# EAGLE board EEZ DIB MIO168 r1B5 (EAGLE 7.2.0), part 1 of 2
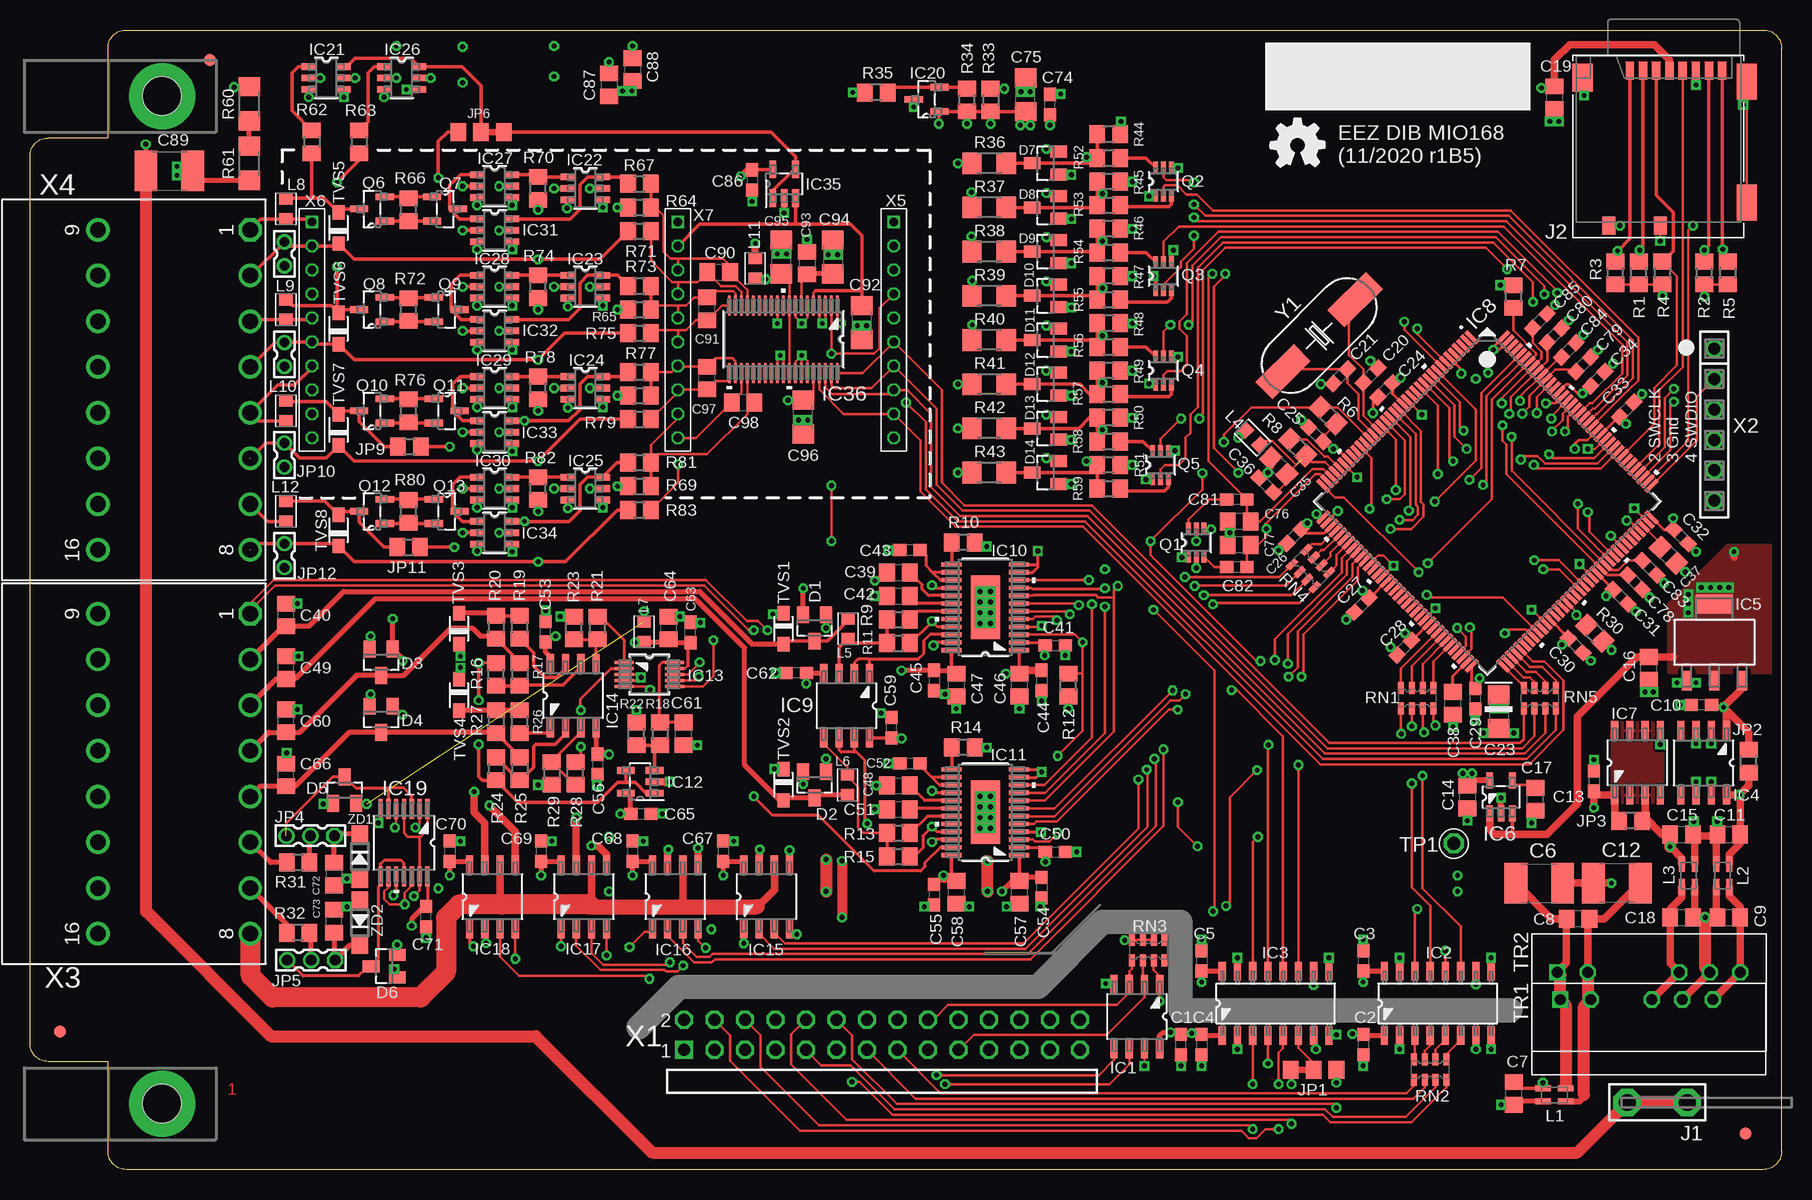
[diagram p6: board, top side]
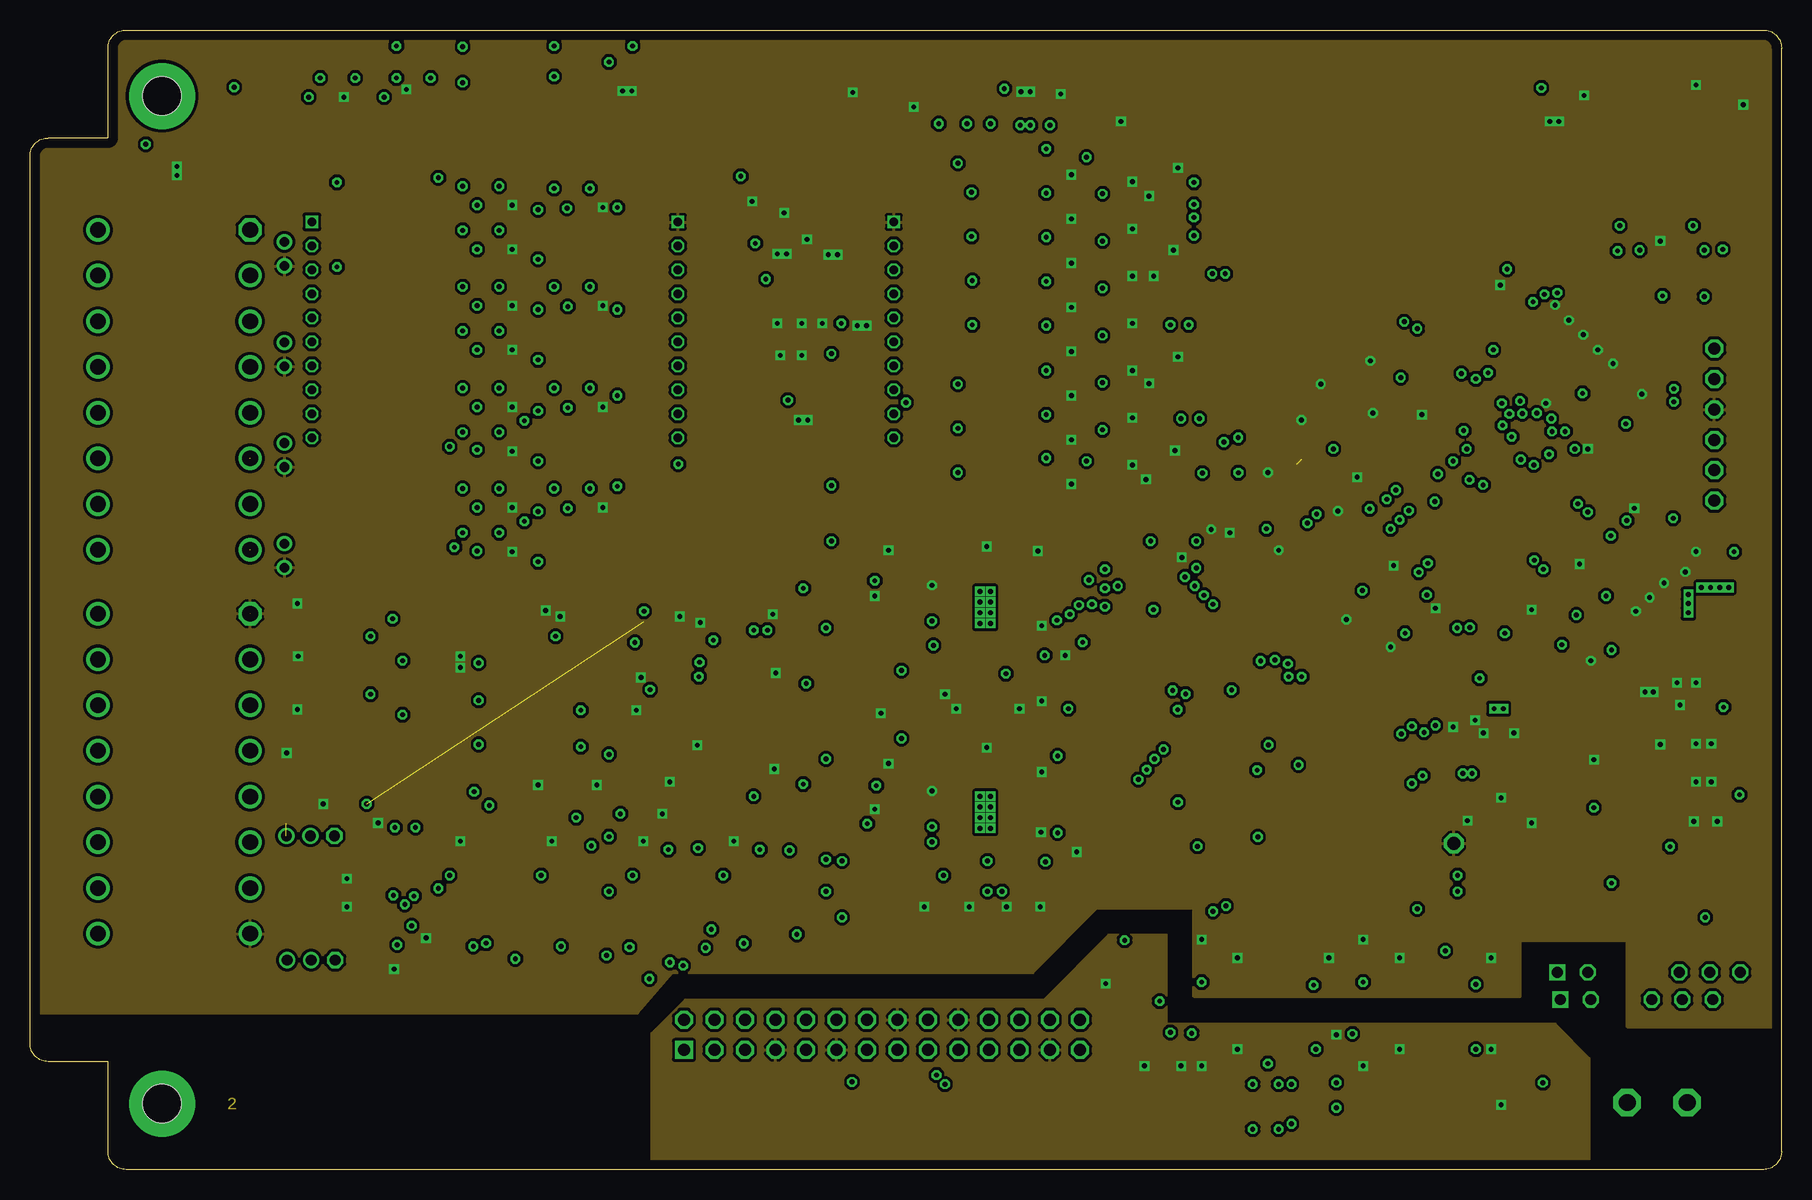
[diagram p7: board, inner layer L2]
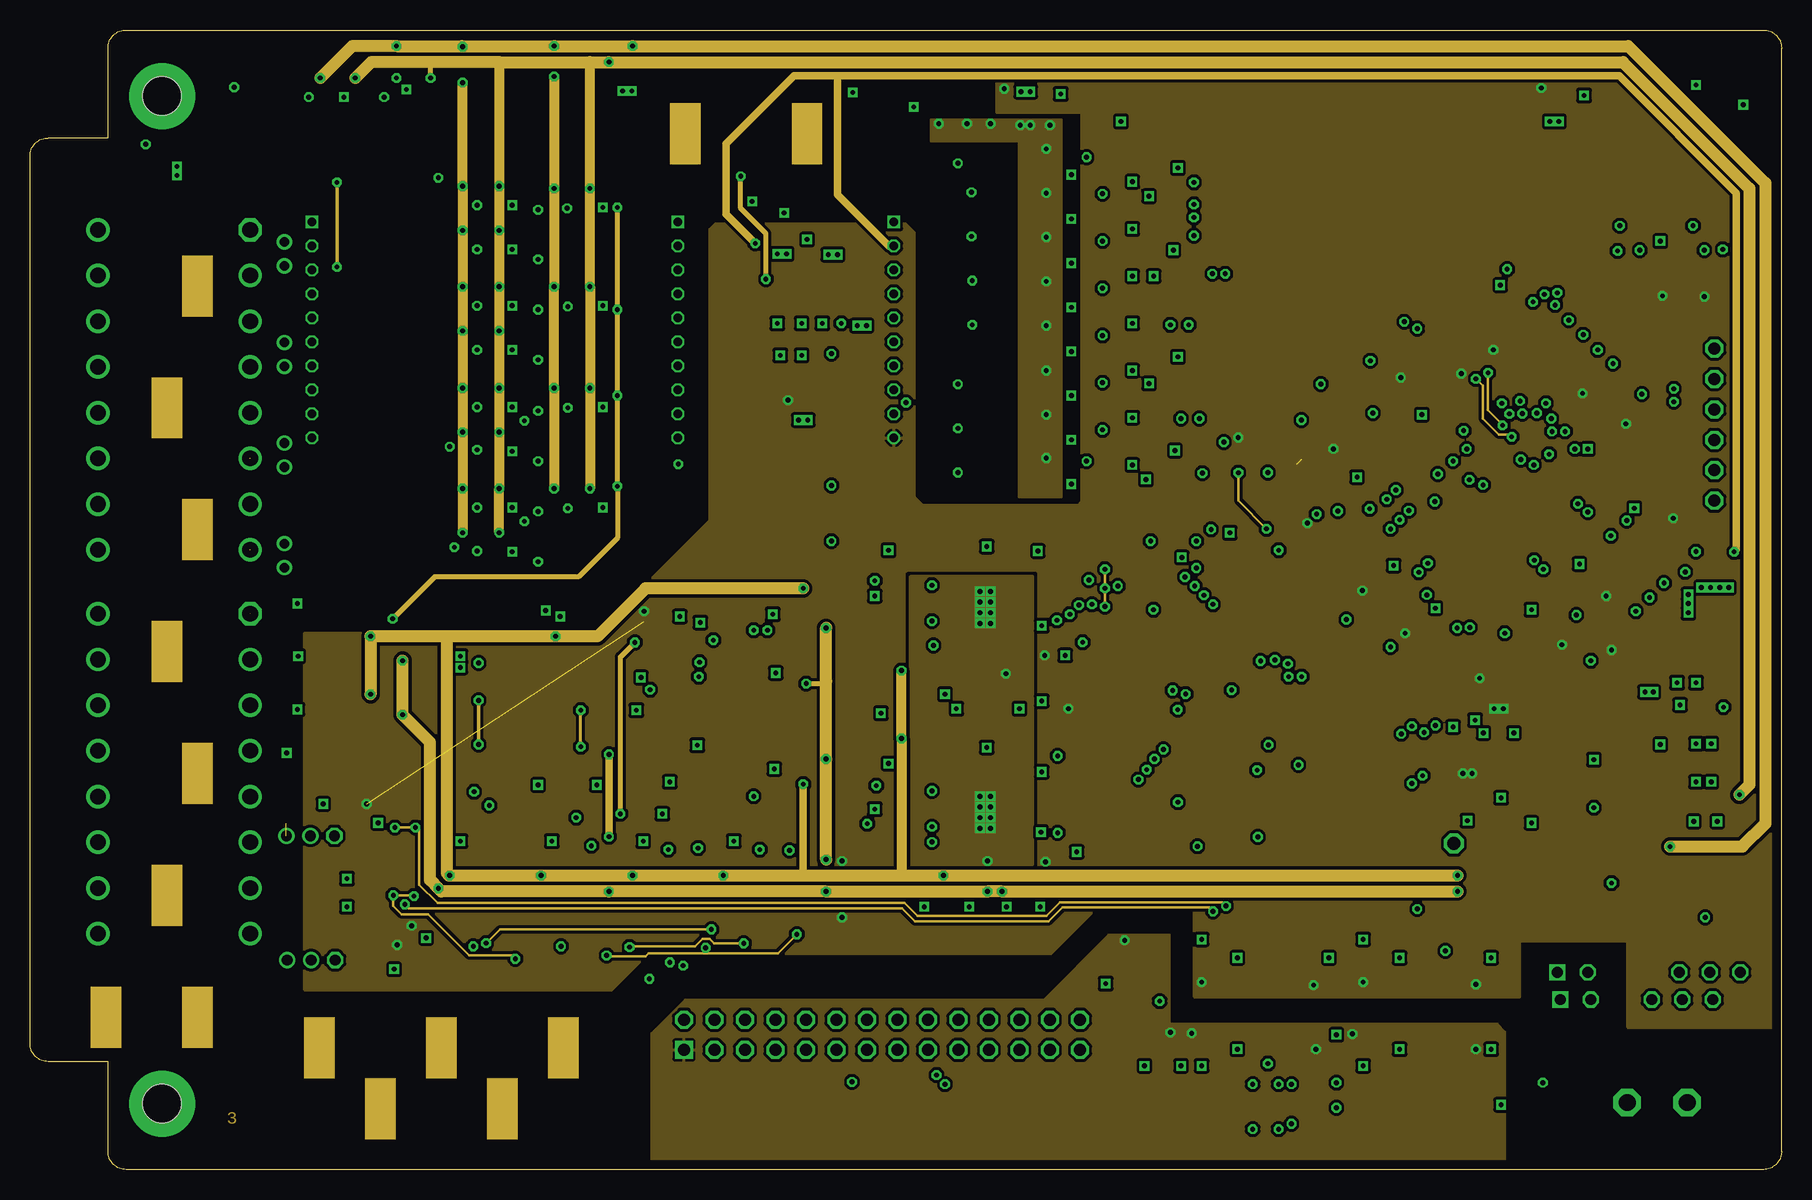
[diagram p8: board, inner layer L3]
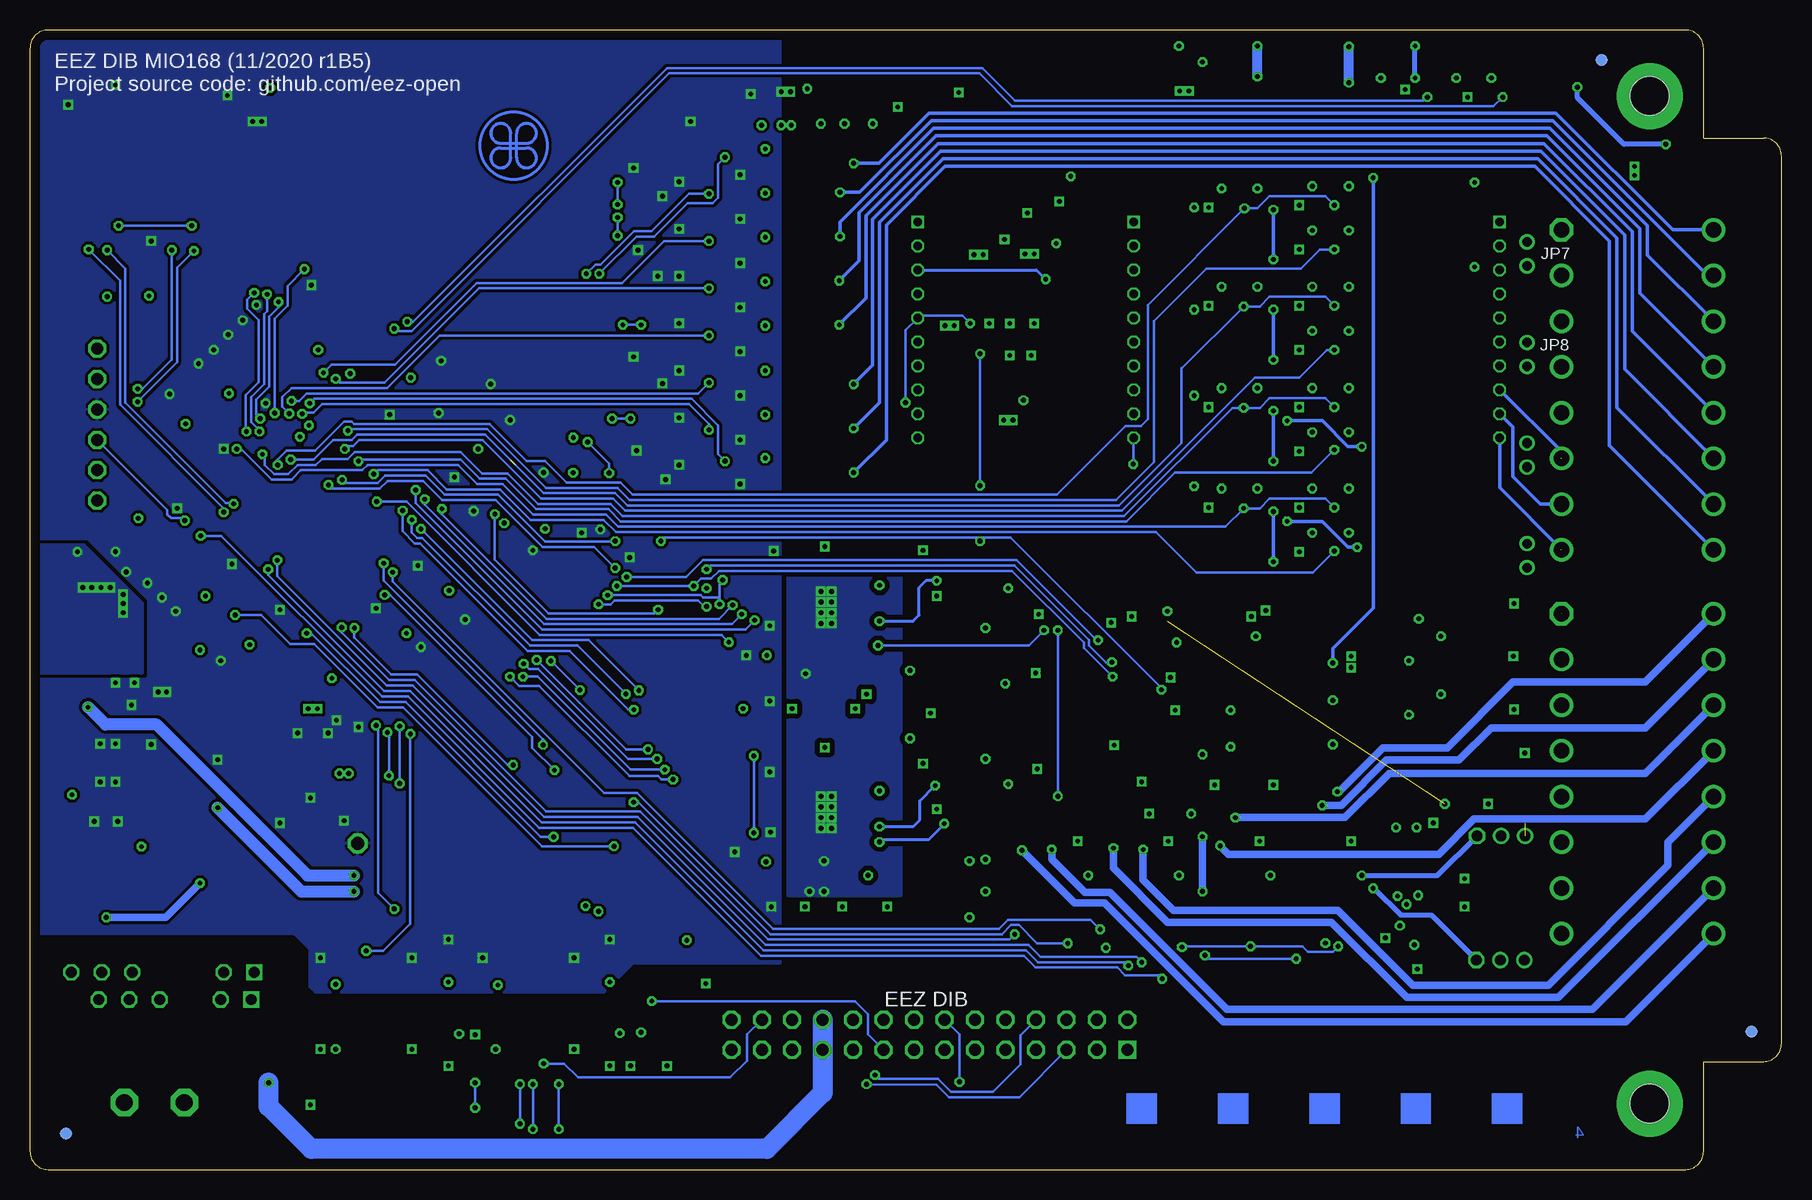
[diagram p9: board, bottom side, seen from below]

Size 146 x 95 mm. Coordinates in mm from the lower left corner, seen from the top.
Outline: 8,95 144.5,95 arc-90 146,93.5 146,1.5 arc-90 144.5,0 8,0 arc-90 6.5,1.5 6.5,9 1.5,9 arc-90 0,10.5 0,84.5 arc-90 1.5,86 6.5,86 6.5,93.5 arc-90 8,95
Copper layers (1+2+15+16): Top 0.035559375mm / dielectric 7mil / L2 0.03048125mm / dielectric 44mil / L3 0.03048125mm / dielectric 7mil / Bottom 0.035559375mm
Design rules "DIB 4-layer": minimum track width 6mil, minimum drill 0.3mm, track to track 4mil, track to pad 4mil, pad to pad 4mil, via to via 4mil, smd to smd 4mil, copper to edge 30mil, drill to drill 8mil, minimum pad ring 4mil, minimum via ring 8mil, stop-mask expansion 2.5mil, vias tented up to drill 0.6mm, thermal gap 8mil
Net classes: 0 default: width 0.203 mm, drill 0.3 mm, clearance 0.203 mm; 1 lvds: width 0.152 mm, drill 0.3 mm, clearance 0.152 mm to class 0, clearance 0.152 mm; 2 gnd: width 0.254 mm, drill 0.584 mm, clearance 0.254 mm; 3 diff_in: width 0.254 mm, drill 0.584 mm, clearance 0.203 mm to class 0, clearance 0.203 mm to class 1, clearance 0.203 mm to class 2, clearance 0.203 mm
vRestrict: area 0,0 to 42,14; area 53,0 to 128,8.5

## Footprints (pad centres in the part's own frame; a part is rotated, then mirrored left to right if it is on the bottom)
C0603 = smd 1.1 x 1: 1 -0.85,0; 2 0.85,0
C1812 = smd 1.9 x 3.4: 1 -1.95,0; 2 1.95,0
C0805 = smd 1.3 x 1.5: 1 -0.95,0; 2 0.95,0
EC1206 = smd 1.6 x 1.8: + -1.4,0; - 1.4,0
C1206 = smd 1.6 x 1.8: 1 -1.4,0; 2 1.4,0
SOT23 = smd 1 x 1.4: 1 -0.95,-1.1; 2 0.95,-1.1; 3 0,1.1
FIDUCIAL_DUAL = smd 1.016 x 1.016 bottom: B 0,0 | smd 1.016 x 1.016: T 0,0
SOIC127P600X173-8N = smd 1.55 x 0.6: 1 -2.7,1.9; 2 -2.7,0.63; 3 -2.7,-0.64; 4 -2.7,-1.91; 5 2.7,-1.91; 6 2.7,-0.64; 7 2.7,0.63; 8 2.7,1.9
SOIC-16 = smd 1.549 x 0.61: 1 -2.692,4.445; 2 -2.692,3.175; 3 -2.692,1.905; 4 -2.692,0.635; 5 -2.692,-0.635; 6 -2.692,-1.905; 7 -2.692,-3.175; 8 -2.692,-4.445; 9 2.692,-4.445; 10 2.692,-3.175; 11 2.692,-1.905; 12 2.692,-0.635; 13 2.692,0.635; 14 2.692,1.905; 15 2.692,3.175; 16 2.692,4.445
SOT230P696X180-4N = smd 1.6 x 0.838: 1 -3.2,2.311; 2 -3.2,0; 3 -3.2,-2.311 | smd 1.6 x 3.099: 4 3.2,0
SOT95P270X145-5N = smd 1.321 x 0.559: 1 -1.372,0.94; 2 -1.372,0; 3 -1.372,-0.94; 4 1.372,-0.94; 5 1.372,0.94
LQFP-144 = smd 1.35 x 0.35: 1 -10.625,8.75; 2 -10.625,8.25; 3 -10.625,7.75; 4 -10.625,7.25; 5 -10.625,6.75; 6 -10.625,6.25; 7 -10.625,5.75; 8 -10.625,5.25; 9 -10.625,4.75; 10 -10.625,4.25; 11 -10.625,3.75; 12 -10.625,3.25; 13 -10.625,2.75; 14 -10.625,2.25; 15 -10.625,1.75; 16 -10.625,1.25; 17 -10.625,0.75; 18 -10.625,0.25; 19 -10.625,-0.25; 20 -10.625,-0.75; 21 -10.625,-1.25; 22 -10.625,-1.75; 23 -10.625,-2.25; 24 -10.625,-2.75; 25 -10.625,-3.25; 26 -10.625,-3.75; 27 -10.625,-4.25; 28 -10.625,-4.75; 29 -10.625,-5.25; 30 -10.625,-5.75; 31 -10.625,-6.25; 32 -10.625,-6.75; 33 -10.625,-7.25; 34 -10.625,-7.75; 35 -10.625,-8.25; 36 -10.625,-8.75; 73 10.625,-8.75; 74 10.625,-8.25; 75 10.625,-7.75; 76 10.625,-7.25; 77 10.625,-6.75; 78 10.625,-6.25; 79 10.625,-5.75; 80 10.625,-5.25; 81 10.625,-4.75; 82 10.625,-4.25; 83 10.625,-3.75; 84 10.625,-3.25; 85 10.625,-2.75; 86 10.625,-2.25; 87 10.625,-1.75; 88 10.625,-1.25; 89 10.625,-0.75; 90 10.625,-0.25; 91 10.625,0.25; 92 10.625,0.75; 93 10.625,1.25; 94 10.625,1.75; 95 10.625,2.25; 96 10.625,2.75; 97 10.625,3.25; 98 10.625,3.75; 99 10.625,4.25; 100 10.625,4.75; 101 10.625,5.25; 102 10.625,5.75; 103 10.625,6.25; 104 10.625,6.75; 105 10.625,7.25; 106 10.625,7.75; 107 10.625,8.25; 108 10.625,8.75 | smd 0.35 x 1.35: 37 -8.75,-10.625; 38 -8.25,-10.625; 39 -7.75,-10.625; 40 -7.25,-10.625; 41 -6.75,-10.625; 42 -6.25,-10.625; 43 -5.75,-10.625; 44 -5.25,-10.625; 45 -4.75,-10.625; 46 -4.25,-10.625; 47 -3.75,-10.625; 48 -3.25,-10.625; 49 -2.75,-10.625; 50 -2.25,-10.625; 51 -1.75,-10.625; 52 -1.25,-10.625; 53 -0.75,-10.625; 54 -0.25,-10.625; 55 0.25,-10.625; 56 0.75,-10.625; 57 1.25,-10.625; 58 1.75,-10.625; 59 2.25,-10.625; 60 2.75,-10.625; 61 3.25,-10.625; 62 3.75,-10.625; 63 4.25,-10.625; 64 4.75,-10.625; 65 5.25,-10.625; 66 5.75,-10.625; 67 6.25,-10.625; 68 6.75,-10.625; 69 7.25,-10.625; 70 7.75,-10.625; 71 8.25,-10.625; 72 8.75,-10.625; 109 8.75,10.625; 110 8.25,10.625; 111 7.75,10.625; 112 7.25,10.625; 113 6.75,10.625; 114 6.25,10.625; 115 5.75,10.625; 116 5.25,10.625; 117 4.75,10.625; 118 4.25,10.625; 119 3.75,10.625; 120 3.25,10.625; 121 2.75,10.625; 122 2.25,10.625; 123 1.75,10.625; 124 1.25,10.625; 125 0.75,10.625; 126 0.25,10.625; 127 -0.25,10.625; 128 -0.75,10.625; 129 -1.25,10.625; 130 -1.75,10.625; 131 -2.25,10.625; 132 -2.75,10.625; 133 -3.25,10.625; 134 -3.75,10.625; 135 -4.25,10.625; 136 -4.75,10.625; 137 -5.25,10.625; 138 -5.75,10.625; 139 -6.25,10.625; 140 -6.75,10.625; 141 -7.25,10.625; 142 -7.75,10.625; 143 -8.25,10.625; 144 -8.75,10.625
PWP24 = smd 1.676 x 0.356: 1 -2.819,3.575; 2 -2.819,2.925; 3 -2.819,2.275; 4 -2.819,1.625; 5 -2.819,0.975; 6 -2.819,0.325; 7 -2.819,-0.325; 8 -2.819,-0.975; 9 -2.819,-1.625; 10 -2.819,-2.275; 11 -2.819,-2.925; 12 -2.819,-3.575; 13 2.819,-3.575; 14 2.819,-2.925; 15 2.819,-2.275; 16 2.819,-1.625; 17 2.819,-0.975; 18 2.819,-0.325; 19 2.819,0.325; 20 2.819,0.975; 21 2.819,1.625; 22 2.819,2.275; 23 2.819,2.925; 24 2.819,3.575 | smd 2.413 x 5.283: 25 0,0
DBV5 = smd 1.473 x 0.559: 1 -1.194,0.95; 2 -1.194,0; 3 -1.194,-0.95; 4 1.194,-0.95; 5 1.194,0.95
DGS10 = smd 1.575 x 0.254: 1 -2.095,1; 2 -2.095,0.5; 3 -2.095,0; 4 -2.095,-0.5; 5 -2.095,-1; 6 2.095,-1; 7 2.095,-0.5; 8 2.095,0; 9 2.095,0.5; 10 2.095,1
PW14 = smd 1.676 x 0.356: 1 -2.819,1.95; 2 -2.819,1.3; 3 -2.819,0.65; 4 -2.819,0; 5 -2.819,-0.65; 6 -2.819,-1.3; 7 -2.819,-1.95; 8 2.819,-1.95; 9 2.819,-1.3; 10 2.819,-0.65; 11 2.819,0; 12 2.819,0.65; 13 2.819,1.3; 14 2.819,1.95
SOT103P240X110-3N = smd 1.524 x 0.559: 1 -1.079,1.016; 2 -1.079,-1.016; 3 1.079,0
DG6_TSOP6 = smd 1.194 x 0.559: 1 -1.448,0.95; 2 -1.448,0; 3 -1.448,-0.95; 4 1.448,-0.95; 5 1.448,0; 6 1.448,0.95
DBT38 = smd 1.676 x 0.229: 1 -2.819,4.5; 2 -2.819,4; 3 -2.819,3.5; 4 -2.819,3; 5 -2.819,2.5; 6 -2.819,2; 7 -2.819,1.5; 8 -2.819,1; 9 -2.819,0.5; 10 -2.819,0; 11 -2.819,-0.5; 12 -2.819,-1; 13 -2.819,-1.5; 14 -2.819,-2; 15 -2.819,-2.5; 16 -2.819,-3; 17 -2.819,-3.5; 18 -2.819,-4; 19 -2.819,-4.5; 20 2.819,-4.5; 21 2.819,-4; 22 2.819,-3.5; 23 2.819,-3; 24 2.819,-2.5; 25 2.819,-2; 26 2.819,-1.5; 27 2.819,-1; 28 2.819,-0.5; 29 2.819,0; 30 2.819,0.5; 31 2.819,1; 32 2.819,1.5; 33 2.819,2; 34 2.819,2.5; 35 2.819,3; 36 2.819,3.5; 37 2.819,4; 38 2.819,4.5
PCB_TAB-4907 = drill 1.4 pad 2.3 octagon: 1 -2.5,0; 2 2.5,0
5033981892 = smd 0.7 x 1.5: 1 4.45,12.6; 2 5.55,12.6; 3 6.65,12.6; 4 7.75,12.6; 5 8.85,12.6; 6 9.95,12.6; 7 11.05,12.6; 8 12.15,12.6 | smd 1.7 x 2.33: S 0.5,12.04 | smd 1.7 x 3: S1 14.2,11.7; S2 14.2,1.6 | smd 1.1 x 1.5: SW1 2.7,-0.3; SW2 7,-0.3
JP3-0805-CUT2 = smd 1.3 x 1.5: COM 0,0; NC 1.9,0; NO -1.9,0
R_0805 = smd 1.3 x 1.5: 1 -0.95,0; 2 0.95,0
ZL303-03P = drill 0.9 pad 1.27: 1 2,0; 2 0,0 | drill 0.9 pad 1.27 octagon: 3 -2,0
2MM-2 = drill 0.8 pad 1.27: 1 0,-1; 2 0,1
PCB-MB = hole 3.2: 0,0
MURATA_DLW21S = smd 1.3 x 0.5: 1 -0.95,-0.55; 2 0.95,-0.55; 3 0.95,0.55; 4 -0.95,0.55
BEAD0603 = smd 1 x 1.1: P$1 -0.85,0; P$2 0.85,0
SC88 = smd 0.991 x 0.406: 1 -1.168,0.65; 2 -1.168,0; 3 -1.168,-0.65; 4 1.168,-0.65; 5 1.168,0; 6 1.168,0.65
R0805 = smd 1.3 x 1.5: 1 -0.95,0; 2 0.95,0
R1206 = smd 1.6 x 1.803: 1 -1.422,0; 2 1.422,0
CAY16 = smd 0.5 x 1: 1 -1.35,-0.85; 2 -0.45,-0.85; 3 0.45,-0.85; 4 1.35,-0.85; 5 1.35,0.85; 6 0.45,0.85; 7 -0.45,0.85; 8 -1.35,0.85
SHORT_NOHOLE = smd 0.5 x 0.25 bottom: 1 0,0.117; 2 0,-0.117
PCB_SHIELD_TAB = drill 1.1 octagon: 1 0,0
TBA2 = drill 0.9 square: 1 0,0 | drill 0.9 octagon: 2 2.54,0; 4 7.62,0; 5 10.16,0; 6 12.7,0
MDD02 = drill 0.9 square: 1 0,0 | drill 0.9 octagon: 2 2.54,0; 5 10.16,0; 6 12.7,0; 7 15.24,0
SOD323-BIDIR = smd 1.2 x 1: C1 -1.3,0; C2 1.3,0
77317-104-28LF = drill 1 pad 1.5 square: 1 -33.02,-2.54 | drill 1 pad 1.5 octagon: 2 -33.02,0; 3 -30.48,-2.54; 4 -30.48,0; 5 -27.94,-2.54; 6 -27.94,0; 7 -25.4,-2.54; 8 -25.4,0; 9 -22.86,-2.54; 10 -22.86,0; 11 -20.32,-2.54; 12 -20.32,0; 13 -17.78,-2.54; 14 -17.78,0; 15 -15.24,-2.54; 16 -15.24,0; 17 -12.7,-2.54; 18 -12.7,0; 19 -10.16,-2.54; 20 -10.16,0; 21 -7.62,-2.54; 22 -7.62,0; 23 -5.08,-2.54; 24 -5.08,0; 25 -2.54,-2.54; 26 -2.54,0; 27 0,-2.54; 28 0,0
SSW-106-02-S-S = drill 1 pad 1.5 octagon: 1 -6.35,0; 2 -3.81,0; 3 -1.27,0; 4 1.27,0; 5 3.81,0; 6 6.35,0
691327310016 = drill 1.3 octagon: 1 -13.335,6.35 | drill 1.3: 2 -9.525,6.35; 3 -5.715,6.35; 4 -1.905,6.35; 5 1.905,6.35; 6 5.715,6.35; 7 9.525,6.35; 8 13.335,6.35; 9 -13.335,-6.35; 10 -9.525,-6.35; 11 -5.715,-6.35; 12 -1.905,-6.35; 13 1.905,-6.35; 14 5.715,-6.35; 15 9.525,-6.35; 16 13.335,-6.35
1-2314878-0 = drill 0.7 square: 1 -9,0 | drill 0.7 octagon: 2 -7,0; 3 -5,0; 4 -3,0; 5 -1,0; 6 1,0; 7 3,0; 8 5,0; 9 7,0; 10 9,0
HC-49/4H = smd 4.5 x 2: 1 -4.25,0; 2 4.25,0
SOD123 = smd 1.4 x 1.4: A 1.9,0; C -1.9,0

## Placement (x,y rotation side)
C1  100n  [C0603]  95.95,10.41 90 top
C2  100n  [C0603]  111.12,10.41 270 top
C3  100n  [C0603]  111.12,17.4 270 top
C4  100n  [C0603]  97.66,10.41 270 top
C5  100n  [C0603]  97.66,17.4 270 top
C6  4n7/1kV  [C1812]  125.79,23.88 0 top
C7  1u  [C0805]  123.7,6.35 90 top
C8  1u  [C0805]  129.03,20.89 180 top
C9  1u  [C0805]  141.6,21.02 0 top
C10  100n  [C0603]  139.32,38.73 180 top
C11  1u  [C0805]  141.6,27.94 0 top
C12  4n7/1kV  [C1812]  132.27,23.88 180 top
C13  100n  [C0603]  130.37,32.38 270 top
C14  2u2  [C0805]  119.82,31.05 270 top
C15  1u  [C0805]  137.67,27.94 0 top
C16  4u7  [C0805]  134.94,41.78 90 top
C17  10n  [C0805]  125.48,30.86 90 top
C18  1u  [C0805]  137.67,21.02 0 top
C19  N.C.  [C0805]  127.06,89.34 270 top
C20  18p  [C0603]  111.75,66.21 225 top
C21  18p  [C0603]  109.22,66.12 45 top
C23  4u7  [EC1206]  122.43,38.16 270 top
C24  100n  [C0603]  112.95,64.99 225 top
C25  100n  [C0603]  107.19,61.28 135 top
C26  100n  [C0603]  105.36,52.78 225 top
C27  100n  [C0603]  111,47.05 225 top
C28  100n  [C0603]  114.55,43.5 225 top
C29  100n  [C0603]  120.46,39.24 270 top
C30  100n  [C0603]  128.84,43.69 315 top
C31  100n  [C0603]  132.59,47.75 315 top
C32  100n  [C0603]  137.63,52.77 315 top
C33  100n  [C0603]  133.1,63.37 45 top
C34  100n  [C0603]  130.68,65.91 45 top
C35  1u  [C0805]  104.09,58.64 135 top
C36  100n  [C0603]  103.05,57.06 135 top
C37  2u2  [C0805]  136.58,51.21 135 top
C38  2u2  [C0805]  118.62,38.86 90 top
C39  2n2  [C0805]  72.39,49.78 0 top
C40  1n  [C0805]  21.34,46.23 90 top
C41  100n  [C0603]  85.47,43.69 0 top
C42  22n  [C0805]  72.39,47.82 0 top
C43  100n  [C0603]  73.34,51.63 180 top
C44  100n  [C0603]  84.33,40.77 270 top
C45  100n  [C0603]  75.37,40.77 270 top
C46  4u7  [C0805]  82.49,40.39 90 top
C47  4u7  [C0805]  77.22,40.39 90 top
C48  2n2  [C0805]  72.39,32 0 top
C49  1n  [C0805]  21.34,41.85 90 top
C50  100n  [C0603]  85.47,26.48 0 top
C51  22n  [C0805]  72.39,30.04 0 top
C52  100n  [C0603]  73.34,33.85 180 top
C53  100n  [C0603]  42.99,44.83 90 top
C54  100n  [C0603]  84.33,23.5 270 top
C55  100n  [C0603]  75.37,22.92 270 top
C56  100n  [C0603]  47.31,33.78 270 top
C57  4u7  [C0805]  82.49,23.11 90 top
C58  4u7  [C0805]  77.22,23.11 90 top
C59  100n  [C0603]  71.82,36.83 90 top
C60  1n  [C0805]  21.34,37.4 90 top
C61  150n  [C0805]  54.48,36.32 90 top
C62  100n  [C0603]  63.88,41.4 180 top
C63  100n  [C0603]  55.05,44.77 90 top
C64  4u7  [C0805]  53.21,45.15 270 top
C65  100n  [C0603]  50.93,29.65 0 top
C66  1n  [C0805]  21.34,32.89 90 top
C67  100n  [C0603]  57.78,26.54 270 top
C68  100n  [C0603]  50.23,26.54 270 top
C69  100n  [C0603]  42.61,26.54 270 top
C70  100n  [C0603]  34.99,26.54 270 top
C71  100n  [C0603]  33.02,21.08 90 top
C72  1u  [C0805]  25.34,24.64 270 top
C73  1u  [C0805]  25.34,20.7 90 top
C74  100n  [C0603]  85.03,88.77 90 top
C75  10u  [C1206]  82.99,89.6 90 top
C76  330p  [C0805]  100.8,54.03 180 top
C77  330p  [C0805]  100.8,52.07 180 top
C78  100n  [C0603]  133.79,48.96 315 top
C79  100n  [C0603]  129.48,67.12 45 top
C80  100n  [C0603]  127.06,69.53 45 top
C81  100n  [C0603]  100.6,55.87 180 top
C82  100n  [C0603]  100.6,50.22 180 top
C83  100n  [C0603]  135,50.16 315 top
C84  100n  [C0603]  128.27,68.33 45 top
C85  100n  [C0603]  125.86,70.74 45 top
C86  100n  [C0603]  60.2,82.49 270 top
C87  1u  [C0805]  48.26,90.42 270 top
C88  1u  [C0805]  50.23,91.69 270 top
C89  4n7/1kV  [C1812]  11.62,83.25 0 top
C90  1n  [C0805]  57.4,74.8 0 top
C91  1n  [C0805]  56.45,71.75 90 top
C92  10u  [C1206]  69.34,70.61 90 top
C93  1u  [C0805]  64.77,75.56 270 top
C94  22u  [C1206]  66.93,76.07 270 top
C95  10u  [C1206]  62.61,76.07 270 top
C96  10u  [C1206]  64.45,62.74 90 top
C97  1n  [C0805]  56.45,65.98 90 top
C98  1n  [C0805]  59.44,63.94 0 top
D1  BAT54SFILM  [SOT23]  65.41,45.15 180 top
D2  BAT54SFILM  [SOT23]  65.41,32.07 180 top
D3  BAT54SFILM  [SOT23]  29.27,42.29 180 top
D4  BAT54SFILM  [SOT23]  29.27,37.53 180 top
D5  BAT54SFILM  [SOT23]  26.23,31.62 0 top
D6  BAT54SFILM  [SOT23]  29.53,16.95 90 top
D7  BAT54SFILM  [SOT23]  84.65,83.88 90 top
D8  BAT54SFILM  [SOT23]  84.65,80.2 90 top
D9  BAT54SFILM  [SOT23]  84.65,76.52 90 top
D10  BAT54SFILM  [SOT23]  84.65,72.83 90 top
D11  BAT54SFILM  [SOT23]  84.65,69.15 90 top
D12  BAT54SFILM  [SOT23]  84.65,65.47 90 top
D13  BAT54SFILM  [SOT23]  84.65,61.79 90 top
D14  BAT54SFILM  [SOT23]  84.65,58.1 90 top
EEZ_SIGNATURE  SIGNATURESMALL  [SIGNATURE_5MM]  105.69,85.36 180 top
FM1  FIDUCIAL_2  [FIDUCIAL_DUAL]  15,92.5 0 top
FM2  FIDUCIAL_2  [FIDUCIAL_DUAL]  143,3 0 top
FM3  FIDUCIAL_2  [FIDUCIAL_DUAL]  2.5,11.5 0 top
IC1  M24C32-WMN6P  [SOIC127P600X173-8N]  92.27,12.76 270 top
IC2  Si8641BB-B-IS1  [SOIC-16]  117.35,13.84 90 top
IC3  Si8641BB-B-IS1  [SOIC-16]  103.82,13.84 90 top
IC4  L78L12  [SOIC127P600X173-8N]  139.51,33.91 270 top
IC5  LM1117MP-5.0  [SOT230P696X180-4N]  140.4,43.94 90 top
IC6  LP2985-33DBVR  [SOT95P270X145-5N]  122.62,31.05 90 top
IC7  L79L12  [SOIC127P600X173-8N]  133.99,33.91 90 top
IC8  STM32F446ZCT6  [LQFP-144]  121.48,55.69 315 top
IC9  OPA2196IDR  [SOIC127P600X173-8N]  68.07,38.67 270 top
IC10  DAC7760IPWPR  [PWP24]  79.63,46.86 180 top
IC11  DAC7760IPWPR  [PWP24]  79.63,29.78 180 top
IC12  OPA376AIDBVR  [DBV5]  50.86,32.32 180 top
IC13  DAC7563TDGSR  [DGS10]  51.63,41.27 0 top
IC14  OPA2196IDR  [SOIC127P600X173-8N]  45.28,39.5 90 top
IC15  BTS3408G  [SOIC127P600X173-8N]  61.4,22.73 90 top
IC16  BTS3408G  [SOIC127P600X173-8N]  53.78,22.73 90 top
IC17  BTS3408G  [SOIC127P600X173-8N]  46.16,22.73 90 top
IC18  BTS3408G  [SOIC127P600X173-8N]  38.54,22.73 90 top
IC19  74HC126PW,118  [PW14]  31.18,27.24 270 top
IC20  TL431B  [SOT103P240X110-3N]  74.74,89.22 180 top
IC21  DG468DV-T1-E3  [DG6_TSOP6]  24.7,91 0 top
IC22  DG468DV-T1-E3  [DG6_TSOP6]  46.29,81.79 0 top
IC23  DG468DV-T1-E3  [DG6_TSOP6]  46.29,73.6 0 top
IC24  DG468DV-T1-E3  [DG6_TSOP6]  46.29,65.15 0 top
IC25  DG468DV-T1-E3  [DG6_TSOP6]  46.29,56.77 0 top
IC26  DG468DV-T1-E3  [DG6_TSOP6]  30.99,91 0 top
IC27  DG468DV-T1-E3  [DG6_TSOP6]  38.73,81.98 0 top
IC28  DG468DV-T1-E3  [DG6_TSOP6]  38.73,73.6 0 top
IC29  DG468DV-T1-E3  [DG6_TSOP6]  38.73,65.15 0 top
IC30  DG468DV-T1-E3  [DG6_TSOP6]  38.73,56.77 0 top
IC31  DG468DV-T1-E3  [DG6_TSOP6]  38.73,78.3 0 top
IC32  DG468DV-T1-E3  [DG6_TSOP6]  38.73,69.91 0 top
IC33  DG468DV-T1-E3  [DG6_TSOP6]  38.73,61.47 0 top
IC34  DG468DV-T1-E3  [DG6_TSOP6]  38.73,53.09 0 top
IC35  OPA376AIDBVR  [DBV5]  62.87,82.17 90 top
IC36  ADS8674IDBT  [DBT38]  62.8,69.22 270 top
J1  4907  [PCB_TAB-4907]  135.64,5.59 180 top
J2  N.C.  [5033981892]  128.91,78.99 0 top
JP1  JP3-CUT-0805-ROTATED  [JP3-0805-CUT2]  107,8.32 180 top
JP2  JP2-CUT-0805  [R_0805]  143.26,34.04 90 top
JP3  JP2-CUT-0805  [R_0805]  133.41,29.08 180 top
JP4  DS1025-01-1*3P8BV1-B  [ZL303-03P]  23.37,27.81 180 top
JP5  DS1025-01-1*3P8BV1-B  [ZL303-03P]  23.43,17.46 180 top
JP6  JP3-CUT-0805-ROTATED  [JP3-0805-CUT2]  37.59,86.49 0 top
JP7  DS1025-01-1*2P8BV1-B  [2MM-2]  21.21,76.33 180 top
JP8  DS1025-01-1*2P8BV1-B  [2MM-2]  21.21,67.94 180 top
JP9  JP2-CUT-0805  [R_0805]  31.62,60.26 0 top
JP10  DS1025-01-1*2P8BV1-B  [2MM-2]  21.21,59.56 180 top
JP11  JP2-CUT-0805  [R_0805]  31.56,51.88 0 top
JP12  DS1025-01-1*2P8BV1-B  [2MM-2]  21.21,51.18 180 top
KK1  PCB-MB  [PCB-MB]  11,89.5 0 top
KK2  PCB-MB  [PCB-MB]  11,5.5 0 top
L1  DLW21SN371SQ2L  [MURATA_DLW21S]  127.06,6.22 0 top
L2  DLW21SN371SQ2L  [MURATA_DLW21S]  141.1,24.51 90 top
L3  DLW21SN371SQ2L  [MURATA_DLW21S]  138.24,24.51 90 top
L4  BLM18AG102SH1D  [BEAD0603]  101.92,61.02 315 top
L5  BLM18AG102SH1D  [BEAD0603]  68.2,45.09 90 top
L6  BLM18AG102SH1D  [BEAD0603]  68.14,32.07 270 top
L7  BLM18AG102SH1D  [BEAD0603]  51.18,44.83 90 top
L8  BLM18AG102SH1D  [BEAD0603]  21.34,80.07 90 top
L9  BLM18AG102SH1D  [BEAD0603]  21.34,71.69 90 top
L10  BLM18AG102SH1D  [BEAD0603]  21.34,63.25 90 top
L11  BLM18AG102SH1D  [BEAD0603]  60.45,75.12 270 top
L12  BLM18AG102SH1D  [BEAD0603]  21.34,54.86 90 top
Q1  2N7002PS,115  [SC88]  97.22,52.26 90 top
Q2  2N7002PS,115  [SC88]  94.49,82.36 90 top
Q3  2N7002PS,115  [SC88]  94.49,74.49 90 top
Q4  2N7002PS,115  [SC88]  94.49,66.61 90 top
Q5  2N7002PS,115  [SC88]  94.23,58.74 90 top
Q6  BSS169  [SOT103P240X110-3N]  28.51,80.07 180 top
Q7  BSS169  [SOT103P240X110-3N]  34.61,80.07 0 top
Q8  BSS169  [SOT103P240X110-3N]  28.51,71.69 180 top
Q9  BSS169  [SOT103P240X110-3N]  34.73,71.69 0 top
Q10  BSS169  [SOT103P240X110-3N]  28.51,63.25 180 top
Q11  BSS169  [SOT103P240X110-3N]  34.73,63.25 0 top
Q12  BSS169  [SOT103P240X110-3N]  28.51,54.86 180 top
Q13  BSS169  [SOT103P240X110-3N]  34.73,54.86 0 top
R1  N.C.  [R0805]  134.11,74.74 90 top
R2  N.C.  [R0805]  139.57,74.74 90 top
R3  N.C.  [R0805]  132.14,74.74 90 top
R4  N.C.  [R0805]  136.08,74.74 90 top
R5  N.C.  [R0805]  141.54,74.74 90 top
R6  4K7  [R0805]  108.2,62.87 135 top
R7  10K  [R0805]  123.63,72.77 270 top
R8  47R  [R0805]  105.66,60.2 135 top
R9  15R  [R0805]  72.39,45.85 0 top
R10  N.C.  [R0805]  77.79,52.26 180 top
R11  15R  [R0805]  72.39,43.88 0 top
R12  10K  [R0805]  86.55,40.39 90 top
R13  15R  [R0805]  72.39,28.07 0 top
R14  N.C.  [R0805]  77.79,35.18 180 top
R15  15R  [R0805]  72.39,26.1 0 top
R16  9K09 0.1%  [R0805]  38.86,41.27 90 top
R17  75K 0.1%  [R0805]  40.83,41.27 270 top
R18  9K09 0.1%  [R0805]  52.51,36.32 270 top
R19  180R  [R0805]  40.83,45.21 90 top
R20  47R  [R0805]  38.86,45.21 270 top
R21  9K09 0.1%  [R0805]  47.31,45.15 90 top
R22  9K09 0.1%  [R0805]  50.55,36.32 90 top
R23  75K 0.1%  [R0805]  45.34,45.15 90 top
R24  9K09 0.1%  [R0805]  38.86,33.4 270 top
R25  75K 0.1%  [R0805]  40.83,33.4 270 top
R26  180R  [R0805]  40.83,37.34 90 top
R27  47R  [R0805]  38.86,37.34 270 top
R28  9K09 0.1%  [R0805]  45.47,33.02 90 top
R29  75K 0.1%  [R0805]  43.5,33.02 270 top
R30  10K  [R0805]  130.43,44.7 135 top
R31  100R  [R0805]  22.35,25.59 180 top
R32  100R  [R0805]  22.35,19.75 180 top
R33  100R  [R0805]  80.07,89.15 270 top
R34  470R  [R0805]  78.11,89.15 90 top
R35  1K8  [R0805]  70.55,89.79 180 top
R36  2K7  [R1206]  79.95,83.88 0 top
R37  2K7  [R1206]  79.95,80.2 0 top
R38  2K7  [R1206]  79.95,76.52 0 top
R39  2K7  [R1206]  79.95,72.83 0 top
R40  2K7  [R1206]  79.95,69.15 0 top
R41  2K7  [R1206]  79.95,65.47 0 top
R42  2K7  [R1206]  79.95,61.79 0 top
R43  2K7  [R1206]  79.95,58.1 0 top
R44  27K  [R0805]  89.92,86.3 180 top
R45  27K  [R0805]  89.92,82.36 180 top
R46  27K  [R0805]  89.92,78.42 180 top
R47  27K  [R0805]  89.92,74.49 180 top
R48  27K  [R0805]  89.92,70.55 180 top
R49  27K  [R0805]  89.92,66.61 180 top
R50  27K  [R0805]  89.92,62.67 180 top
R51  27K  [R0805]  89.92,58.74 180 top
R52  1K  [R0805]  89.92,84.33 0 top
R53  1K  [R0805]  89.92,80.39 0 top
R54  1K  [R0805]  89.92,76.45 0 top
R55  1K  [R0805]  89.92,72.52 0 top
R56  1K  [R0805]  89.92,68.58 0 top
R57  1K  [R0805]  89.92,64.64 0 top
R58  1K  [R0805]  89.92,60.71 0 top
R59  1K  [R0805]  89.92,56.77 0 top
R60  470K  [R1206]  18.29,88.84 270 top
R61  470K  [R1206]  18.29,83.88 270 top
R62  10K  [R0805]  23.5,85.66 270 top
R63  10K  [R0805]  27.43,85.66 270 top
R64  N.C.  [R0805]  50.8,80.2 0 top
R65  N.C.  [R0805]  50.8,71.69 0 top
R66  47R  [R0805]  31.56,80.01 90 top
R67  100R  [R0805]  50.8,82.17 0 top
R68  N.C.  [R0805]  50.8,64.52 0 top
R69  N.C.  [R0805]  50.8,56.96 0 top
R70  100R  [R0805]  42.35,81.79 90 top
R71  154R  [R0805]  50.8,78.23 0 top
R72  47R  [R0805]  31.56,71.69 90 top
R73  100R  [R0805]  50.8,73.66 0 top
R74  100R  [R0805]  42.35,73.6 90 top
R75  154R  [R0805]  50.8,69.72 0 top
R76  47R  [R0805]  31.56,63.25 90 top
R77  100R  [R0805]  50.8,66.48 0 top
R78  100R  [R0805]  42.35,65.15 90 top
R79  154R  [R0805]  50.8,62.55 0 top
R80  47R  [R0805]  31.56,54.86 90 top
R81  100R  [R0805]  50.8,58.93 0 top
R82  100R  [R0805]  42.35,56.77 90 top
R83  154R  [R0805]  50.8,54.99 0 top
RN1  DR1206-33R-4/8  [CAY16]  115.63,39.31 0 top
RN2  DR1206-33R-4/8  [CAY16]  116.71,8.32 180 top
RN3  DR1206-10K-4/8  [CAY16]  93.22,18.29 0 top
RN4  DR1206-33R-4/8  [CAY16]  106.74,50.1 315 top
RN5  DR1206-33R-4/8  [CAY16]  125.86,39.31 0 top
SH1  [SHORT_NOHOLE]  18.35,46.48 180 bottom
SH2  [SHORT_NOHOLE]  18.22,19.68 270 bottom
TP1  [PCB_SHIELD_TAB]  118.68,27.18 0 top
TR1  TBA2-1223  [TBA2]  127.57,14.16 0 top
TR2  MDD02M-15  [MDD02]  127.32,16.45 0 top
TVS1  PESD12VL1BA,115  [SOD323-BIDIR]  62.8,45.09 270 top
TVS2  PESD12VL1BA,115  [SOD323-BIDIR]  62.8,32.07 270 top
TVS3  PESD12VL1BA,115  [SOD323-BIDIR]  35.75,45.09 90 top
TVS4  PESD12VL1BA,115  [SOD323-BIDIR]  35.75,39.56 270 top
TVS5  PESD12VL1BA,115  [SOD323-BIDIR]  25.72,78.49 90 top
TVS6  PESD12VL1BA,115  [SOD323-BIDIR]  25.72,70.1 90 top
TVS7  PESD12VL1BA,115  [SOD323-BIDIR]  25.72,61.66 90 top
TVS8  PESD12VL1BA,115  [SOD323-BIDIR]  25.72,53.28 90 top
X1  77317-104-28LF  [77317-104-28LF]  87.54,12.5 0 top
X2  SSW-106-02-S-S  [SSW-106-02-S-S]  140.4,62.1 270 top
X3  691327310016  [691327310016]  12,33 270 top
X4  691327310016  [691327310016]  12,65 270 top
X5  1-2314878-0  [1-2314878-0]  72,70 270 top
X6  1-2314878-0  [1-2314878-0]  23.5,70 270 top
X7  1-2314878-0  [1-2314878-0]  54,70 270 top
Y1  25MHz  [HC-49/4H]  107.45,69.52 45 top
ZD1  MMSZ4700T1G  [SOD123]  27.5,26.1 270 top
ZD2  MMSZ4700T1G  [SOD123]  27.5,20.57 90 top

## Tracks (layer width: path | path; a pad name or v marks a point on that pad's centre or on a via)
1V25_REF  (via drill 0.4)
  Top 0.254: R16.2 v37.4,42.23
  Top 0.305: 49.66,32.26 50.48,32.26 51.37,31.37 IC12.1 | 49.66,32.26 48.96,32.26 47.31,30.61 40.7,30.61 R24.2 37.72,32.45 37.4,32.77 v37.4,35.43 | IC12.4 49.67,32.27 49.66,32.26 | v37.4,39.12 v37.4,42.23 | JP6.NO 34.8,86.49 34.04,85.72 v34.04,82.68
  L3 0.305: v37.4,35.43 v37.4,39.12
  Bottom 0.305: v34.04,82.68 34.04,46.8 37.4,43.43 v37.4,42.23
2V5_REF
  Top 0.254: IC13.10 52.69,42.27 52.45,42.04 52.45,37.34 R18.1 C61.2
!ADC_CS
  Top 0.203: RN5.1 124.51,35.86 124.21,35.56 108.33,35.56 88.52,55.37 77.92,55.37 76.01,57.28 76.01,64.99 X5.6 69.4,66.4 IC36.38
!DAC_ALARM  (via drill 0.4)
  Top 0.203: R12.2 87.74,41.34 87.75,41.34 | IC8.9 120.52,63.36 120.52,59.12 v117.09,55.69 | IC11.3 83.62,27.51 83.76,27.37 84.96,27.37 v85.66,28.07 | v85.66,34.48 87.75,36.56 87.75,41.34 | 87.75,41.34 v87.75,43.95 87.11,44.59 IC10.3
  Bottom 0.203: v85.66,34.48 v85.66,28.07 | v117.09,55.69 114.62,55.69 103.5,44.58 88.37,44.58 v87.75,43.95
!DAC_CS_DUAL  (via drill 0.4)
  Top 0.203: IC13.6 56.09,40.27 56.96,41.15 v56.96,44.13 | v96.27,49.4 104.14,49.4 RN4.1
  Bottom 0.203: v96.27,49.4 91.31,49.4 89.92,50.8 63.75,50.8 57.09,44.13 v56.96,44.13
!OUT_FAULT  (via drill 0.4)
  Top 0.203: IC17.1 v44.26,18.61 | IC15.1 v59.51,18.86 v59.5,18.86 | IC16.1 51.88,19.82 51.25,19.82 v49.97,18.54 | R30.2 v128.91,46.23 | v128.91,46.23 | v128.91,46.23 128.91,46.49 IC8.88 | v95.69,30.62 95.69,28.57 v97.32,26.95
  Top 0.254: IC18.1 36.65,18.92 v36.96,18.61
  L3 0.203: v59.5,18.86 57.02,18.86 56.64,19.24 56.07,19.24 55.44,18.61 50.04,18.61 v49.97,18.54
  Bottom 0.203: v128.91,46.23 126.75,46.23 124.33,43.81 122.3,43.81 117,38.52 114.88,38.52 103.31,26.95 102.25,26.95 v97.32,26.95 | v49.97,18.54 49.91,18.61 v44.26,18.61 39.94,18.61 39.5,18.16 37.4,18.16 v36.96,18.61 | v59.5,18.86 62.05,18.86 63.58,20.38 64.24,20.38 65,19.62 84.26,19.62 95.26,30.62 v95.69,30.62
!RESET  (via drill 0.4)
  Top 0.203: IC13.5 51.42,40.27 v51.69,40.01 | v66.8,57.02 v66.8,52.39 | IC36.2 66.8,68.52 v66.8,68.01 70.36,68.01 70.8,68.45 70.8,71.8 X5.4 | IC3.12 104.46,36.12 100.61,39.97 v100.17,39.97 | v102.58,42.39 102.23,42.39 93.41,51.22 v93.41,52.39 97.73,56.71 v97.73,58.05 | IC8.25 109.03,63.54 R6.2 101.8,63.54 99.52,61.25 v99.52,60.64
  Bottom 0.203: 66.8,52.7 64.26,52.7 51.69,40.13 v51.69,40.01 | 66.8,52.7 93.09,52.7 v93.41,52.39 | v66.8,57.02 v66.8,68.01 | v66.8,52.39 66.8,52.7 | v100.17,39.97 v100.17,39.98 v102.58,42.39 | v97.73,58.05 97.73,58.85 v99.52,60.64
+3V3  (via drill 0.4)
  Top 0.203: IC2.7 v120.52,10.03 | RN3.6 RN3.7 RN3.8 91.27,19.14 v91.25,19.11 | IC3.7 107,10.22 v107.19,10.03
  Top 0.406: v110.24,11.3 111.09,11.3 C2.1 111.24,11.15 IC2.1 | C1.2 96.73,11.26 v96.84,11.37 97.56,11.37 C4.1 97.78,11.15 IC3.1 | IC1.8 94.17,11.17 94.42,11.43 v95.06,11.43
  pour L3 (isolate 0.254): 54.61,14.16 84.52,14.16 89.92,19.56 95,19.56 95,12.19 122.3,12.13 122.94,11.49 122.94,-0.25 51.82,-0.25 51.82,11.37
+3V3_ISO  (via drill 0.4)  (1 unrouted)
  Top 0.203: IC36.34 65.3,64.16 C96.2 | R3.1 R1.1 R4.1 v136.08,72.83 | R5.1 R2.1 v139.57,72.77 | R30.1 v131.83,43.31 | v131.83,43.31 | C25.1 107.63,60.83 107.63,60.95 R6.1
  Top 0.254: IC10.2 84.37,43.94 C41.1 84.62,42.9 v84.58,42.86 | R12.1 v86.55,38.42 | IC11.2 84.62,26.86 C50.1 84.64,26.84 v84.64,25.65 | 32.94,22.01 C71.2 33.13,22.04 IC19.14 | IC8.84 128.24,44.33 C30.1 v127.7,43.75 | IC8.95 C31.1 131.92,48.35 v131.38,47.82 | v136.97,54.29 136.97,53.43 C32.1 136.17,53.37 IC8.108 | IC8.121 132.45,62.77 C33.1 132.5,62.7 v133.03,62.17 | C34.1 130.02,65.31 v129.41,64.71 129.03,64.71 128.27,65.47 128.07,65.47 IC8.131 | IC8.144 121.98,68.57 v121.98,68.33 122.44,68.33 IC8.143 | IC8.6 119.32,66.69 v119.32,66.36 | IC8.17 113.56,64.67 C24.1 113.82,65.59 v114.26,66.03 | C25.1 108.39,60.07 v108.65,60.07 108.96,60.07 IC8.30 | IC8.39 107.85,53.02 105.85,53.02 C26.1 v106.48,53.89 | v111.06,48.26 111.6,47.72 C27.1 111.67,47.66 IC8.52 | IC8.62 115.19,44.1 C28.1 115.16,44.17 v114.62,44.7 | C23.+ 122.81,39.18 v122.81,38.42 | v100.71,61.02 L4.P$1 | v120.84,40.96 120.46,40.32 C29.1 120.15,40.4 IC8.72 | v28.07,30.48 27.22,30.48 D5.2 | v30.61,18.73 30.61,17.93 D6.2
  Top 0.406: R33.1 v81.21,90.1 v81.22,90.11 | C96.2 v63.19,64.14 v63.18,64.14 | v51.18,46.55 L7.P$2 | IC3.16 97.68,16.54 C5.2 v97.66,15.62 | IC2.16 111.14,16.54 C3.2 v111.12,15.62 | IC2.10 v120.52,15.43 | IC3.10 v107,15.37 | 31.81,20.83 v31.81,20.32 31.81,20.89 32.94,22.01
  Top 0.508: IC6.5 120.25,32.42 | 120.25,32.42 C14.1 | v120.21,33.02 120.21,32.46 120.25,32.42
  Top 0.61: J2.4 136.65,92.52 135.38,93.79 128.33,93.79 127.06,92.52 C19.1 127.06,90.17 v125.98,90.17
  Top 0.813: v67.69,25.72 v67.69,21.02
  other vias: 119.44,33.02 122.05,38.42
  pour L3 (isolate 0.254, rank 2): 56.64,54.1 46.23,43.69 46.23,44.7 22.86,44.7 22.86,14.99 48.51,14.99 51.56,18.03 85.15,18.03 88.9,21.78 97.03,21.78 97.03,14.41 124.21,14.41 124.21,19.05 133.16,19.05 133.16,11.87 145.54,11.87 145.54,93.98 144.78,94.74 80.58,94.61 80.58,88.14 87.63,88.14 87.63,55.63 87.38,55.37 74.42,55.37 73.72,56.07 73.72,78.11 73.03,78.8 57.09,78.8 56.64,78.36
+5V_ISO  (via drill 0.4)
  Top 0.305: IC6.3 123.56,28.02 123.64,27.94
  Top 0.61: L11.P$1 v60.45,77.22 | IC6.1 121.68,28.31 122.05,27.94 123.64,27.94 126.43,27.94 128.97,30.48 128.97,37.78 133.92,42.73 C16.2 136.97,42.73 136.97,42.74 | v142.05,51.5 142.05,51.05
  L3 0.61: 67.37,91.19 132.46,91.19 142.24,81.41 142.24,51.69 v142.05,51.5 | v60.45,77.22 58.04,79.63 58.04,85.53 63.69,91.19 67.37,91.19 | X5.2 71.59,77 67.31,81.28 67.31,91.12 67.37,91.19
  other vias: 140.84,48.51 141.6,48.51 140.08,48.51 138.24,46.42 138.24,47.18 138.24,47.94 139.32,48.51
  pour Top (isolate 0.305, no thermals): 136.59,41.47 136.59,47.18 141.48,52.07 145.8,52.07 145.8,41.4 136.59,41.4
  pour Bottom (isolate 0.305, no thermals): 136.59,41.47 136.59,47.18 141.48,52.07 145.8,52.07 145.8,41.4 136.59,41.4
+12V  (via drill 0.4)
  Top 0.305: C7.2 124.22,6.77 L1.4 v126.11,7.24
  Bottom 1.676: v126.11,7.24 126.11,5.27 122.56,1.71 84.58,1.71 79.92,6.38 X1.21 X1.22
+12V_CM
  Top 0.406: 128.02,7.05 L1.3
  Top 0.61: C6.1 126.83,20.89 C8.2 128.08,17.21 TR2.1
  Top 1.016: TR2.1 127.57,16.19 TR1.1 128.02,13.72 128.02,7.05
+12V_ISO  (via drill 0.4)
  Top 0.254: v43.81,44.45 43.46,44.45 C53.1
  Top 0.305: IC10.24 76.81,41.37 C47.2 | IC9.8 C59.1 71.86,35.94 v72.64,35.94 | IC11.24 76.81,24.1 C58.2 | v141.16,38.54 140.55,38.54 C10.1
  Top 0.406: IC18.8 36.38,25.69 C70.2 v34.99,24.51 | IC17.8 44.01,25.69 C69.2 v42.61,24.51 | IC16.8 51.62,25.69 C68.2 v50.23,24.51 | IC15.8 59.24,25.69 C67.2 v57.78,24.51 | C47.2 76.49,41.62 C45.1 72.67,41.62 v72.64,41.59 | D2.2 v64.45,32.13 | IC14.8 43.38,42.73 42.99,43.12 C53.1 | 76.81,24.1 76.2,24.1 | 76.2,24.1 75.7,24.1 C55.1 | v76.14,24.51 76.14,24.17 76.2,24.1 | D1.2 v64.45,48.45 | D4.2 28.32,39.69 v28.38,39.62 | D3.2 28.32,44.39 v28.38,44.45 | C72.1 25.34,27.78 JP4.3 25.55,28 ZD1.C
  Top 0.508: 140.35,38.75 C10.1
  Top 0.61: IC4.1 141.41,38.3 v141.16,38.54 | JP2.2 143.26,36.45 v141.16,38.54 | IC5.3 142.71,40.09 v141.16,38.54
  L3 0.61: v64.45,32.13 64.45,24.64 64.33,24.51
  L3 0.813: 72.39,24.51 72.64,24.77 v72.64,35.94 v72.64,41.59
  L3 1.016: v34.99,24.51 v42.61,24.51 v50.23,24.51 v57.78,24.51 64.33,24.51 72.39,24.51 v76.14,24.51 v119,24.51 | v64.45,48.45 51.31,48.45 47.31,44.45 v43.81,44.45 34.54,44.45 | v28.38,39.62 v28.38,44.45 34.54,44.45 | v34.99,24.51 34.92,24.51 34.73,24.7 | 34.54,44.45 34.73,44.2 34.73,24.77 v34.99,24.51
  Bottom 0.406: v34.99,24.51 28.67,24.51 JP4.3
  Bottom 1.016: v141.16,38.54 139.7,37.08 135.45,37.08 122.87,24.51 v119,24.51
+15V_ISO  (via drill 0.4)
  Top 0.305: IC31.5 v39.12,78.3 | IC27.5 v39.12,81.98 | IC22.5 v46.67,81.79 | IC34.5 v39.12,53.09 | IC30.5 v39.12,56.77 | v39.12,61.47 IC33.5 | v39.12,65.15 IC29.5 | v39.12,69.91 IC32.5 | v39.12,73.6 IC28.5 | IC23.5 v46.67,73.6 | IC24.5 v46.67,65.15 | IC25.5 v46.67,56.77
  Top 0.406: C87.1 v48.26,92.33 | IC26.5 v33.4,91 | IC21.5 v27.11,91
  Top 0.61: JP2.1 143.26,32 v142.49,31.24 | IC4.8 142.46,31.21 v142.49,31.24 | L2.2 141.65,26.27 142.56,27.18 C11.2 142.56,31.18 v142.49,31.24
  L3 0.406: v33.4,91 33.4,92.27 33.34,92.33
  L3 0.813: v39.12,53.09 v39.12,56.77 v39.12,61.47 v39.12,65.15 v39.12,69.91 v39.12,73.6 v39.12,78.3 v39.12,81.98 39.12,92.33 | v46.67,56.77 v46.67,65.15 v46.67,73.6 v46.67,81.79 46.67,92.33
  L3 1.016: v27.11,91 28.45,92.33 33.34,92.33 39.12,92.33 46.67,92.33 v48.26,92.33 132.78,92.33 143.32,81.79 143.32,32.07 v142.49,31.24
+VSENSE1
  Top 0.254: 69.91,42.55 69.03,42.55 68.71,42.23 IC9.2 | IC9.1 69.97,42.49 69.91,42.55 | IC10.22 75,44.59 74.49,44.07 74.49,42.99 74.04,42.55 69.91,42.55
+VSENSE2  (via drill 0.4)
  Top 0.203: 76.8,27.5 IC11.22
  Top 0.254: 68.71,34.8 68.9,34.8 69.6,34.1 69.6,29.02 v69.79,28.83 | 68.71,34.8 67.62,34.8 67.43,34.99 IC9.6 | IC9.7 68.7,34.8 68.71,34.8 | IC11.22 75.39,27.51 v75.18,27.3
  Bottom 0.254: v69.79,28.83 71.12,27.5 74.99,27.5 v75.18,27.3
-12V_ISO  (via drill 0.4)
  Top 0.254: IC10.1 82.45,41.37 C46.2 | v80.07,46.42 IC10.25 | v80.07,29.34 IC11.25
  Top 0.305: 66.11,41.43 IC9.4 | 64.58,41.62 C62.1 | C57.2 82.49,26.17 IC11.1 | R64.1 v48.96,80.2 | R65.1 v48.96,71.69 | R68.1 v48.96,64.52 | 66.42,46.18 66.42,45.21 v66.36,45.15 | D4.1 30.33,38.63 v31.05,37.91
  Top 0.406: C54.1 82.77,24.34 C57.2 81.91,24.06 v81.03,23.18 | 64.58,41.55 C62.1 | R69.1 v48.96,56.96 | IC14.4 47.19,34.75 C56.1 | D1.1 66.42,46.18 | D2.1 v66.36,34.22 v66.36,34.23 | C62.1 64.73,40.54 v64.71,40.51 | IC9.4 64.76,41.37 C62.1 | D3.1 30.22,43.37 | 82.45,41.37 81.38,41.37 v81.34,41.34 | D3.1 v30.22,45.91 v30.23,45.91 | C73.1 25.34,17.56 JP5.3 26.64,18.67 ZD2.C | D3.1 31.05,42.56 v31.05,42.42
  Top 0.61: 84.35,41.59 C44.1 82.77,41.62 C46.2 | JP3.2 132.09,29.46 IC7.1 130.48,31.21 C13.2 v130.37,30.16 | C56.1 48.24,34.63 v48.26,34.61
  Top 1.016: v66.36,25.84 v66.36,23.18 | v79.82,23.18 v79.82,25.72
  L3 0.406: v48.96,80.2 v48.96,71.69 v48.96,64.52 v48.96,56.96 48.96,52.64 45.72,49.4 33.72,49.4 v30.23,45.91 | v64.71,40.51 66.17,40.51 66.36,40.7
  L3 0.61: v48.26,34.61 v48.26,27.75
  L3 1.016: v31.05,42.42 v31.05,37.91 33.34,35.62 33.34,24.13 v34.04,23.43 34.29,23.18 v48.26,23.18 v66.36,23.18 v79.82,23.18 v81.03,23.18 v119,23.18 | v66.36,25.84 v66.36,34.23 66.36,40.7 v66.36,45.15
  Bottom 0.406: v34.04,23.43 33.97,23.43 31.75,21.21 29.18,21.21 JP5.3
  Bottom 0.61: v48.26,27.75 v48.26,23.18
  Bottom 1.016: v130.37,30.16 123.38,23.18 v119,23.18
  other vias: 79.18,46.42 79.18,47.31 79.18,48.2 79.18,45.53 80.07,45.53 80.07,48.2 80.07,47.31 79.18,30.23 80.07,30.23 80.07,31.11 79.18,31.11 79.18,29.34 80.07,28.45 79.18,28.45
  pour L3 (isolate 0.254): 73.41,49.47 83.57,49.47 83.57,25.4 73.41,25.4
  pour Bottom (isolate 0.406, rank 3): 73.34,49.47 83.5,49.47 83.5,22.86 73.34,22.86
-15V_ISO  (via drill 0.4)
  Top 0.305: IC27.2 v36.07,81.98 | IC31.2 v36.07,78.3 | IC22.2 v43.69,81.79 | IC28.2 v36.07,73.6 | IC32.2 v36.07,69.91 | IC29.2 v36.07,65.15 | IC33.2 v36.07,61.47 | IC30.2 v36.07,56.77 | IC34.2 v36.07,53.09 | IC23.2 v43.69,73.6 | v43.69,56.77 IC25.2 | IC24.2 v43.69,65.15
  Top 0.406: C88.1 v50.23,93.66 | IC21.2 v24.19,91 | IC26.2 v30.54,91
  Top 0.61: L3.3 137.69,25.95 v136.72,26.92 | IC7.3 134.62,29.34 | 134.62,29.34 JP3.1 | 134.62,29.34 136.03,27.94 C15.1
  Top 1.016: v136.72,26.92 C15.1
  L3 0.813: v43.69,91.12 v43.69,81.79 v43.69,73.6 v43.69,65.15 v43.69,56.77 | v36.07,93.6 36.01,93.66 | v36.07,90.61 v36.07,81.98 v36.07,78.3 v36.07,73.6 v36.07,69.91 v36.07,65.15 v36.07,61.47 v36.07,56.77 v36.07,53.09
  L3 1.016: v24.19,91 26.86,93.66 v30.54,93.66 36.01,93.66 v43.69,93.66 v50.23,93.66 133.22,93.66 144.65,82.23 144.65,28.83 142.75,26.92 v136.72,26.92
  Bottom 0.406: v30.54,91 v30.54,93.66
  Bottom 0.813: v43.69,91.12 v43.69,93.66 | v36.07,90.61 v36.07,93.6
  pour Top: 131.89,37.27 136.08,37.27 136.08,30.54 131.89,30.54
-VSENSE  (via drill 0.4)
  Top 0.203: v60.33,44.96 59.94,44.96 56.2,48.7 20.46,48.7 SH1.2 18.35,47.18 20.32,49.15 56.33,49.15 59.75,45.72 60.71,45.72 v61.47,44.96
  Top 0.254: IC11.23 75.88,26.86 74.61,25.59 74.61,25.27 74.23,24.89 70.36,24.89 65.72,29.53 61.91,29.53 v60.33,31.11 | IC10.23 75.56,43.94 v75.31,43.69
  Bottom 0.203: v75.31,43.69 62.74,43.69 v61.47,44.96 | v60.33,31.11 v60.33,44.96
ADC_AVDD  (via drill 0.4)
  Top 0.203: C95.2 63.3,74.05 IC36.9 IC36.30
  Top 0.305: IC35.5 60.22,83.36 C86.1
  Top 0.406: L11.P$2 61.3,74.27 v61.34,74.23 62.23,74.23 C95.2 | C86.1 59.78,83.34 v59.24,82.8
  L3 0.406: v59.24,82.8 59.24,80.14 61.34,78.04 v61.34,74.23
  Bottom 0.254: X5.3 62.11,75 v61.34,74.23
ADC_IRQ
  Top 0.203: IC8.77 125.27,42.35 126.24,42.35 127.83,40.77 127.83,36.64 124.97,33.78 107.57,33.78 87.76,53.59 77.15,53.59 74.23,56.52 74.23,60.77 X5.9 67.82,62.99 65.8,65.01 IC36.35
ADC_MISO
  Top 0.203: RN5.3 126.31,36.39 124.59,34.67 107.95,34.67 88.14,54.48 77.53,54.48 75.12,56.9 75.12,62.99 73.15,64.96 72.04,64.96 X5.8 71.64,64.64 66.86,64.64 66.3,65.21 IC36.36
ADC_MOSI  (via drill 0.4)
  Top 0.203: RN5.4 127.21,36.66 124.78,34.23 107.76,34.23 87.95,54.04 77.34,54.04 74.68,56.71 74.68,62.29 v73.03,63.94 | IC36.1 67.3,70.87 v67.63,70.55
  Bottom 0.203: v67.63,70.55 68.26,71.18 71.82,71.18 X5.5 73.03,69.97 v73.03,63.94
ADC_SCLK
  Top 0.203: RN5.2 125.41,36.13 124.4,35.12 108.14,35.12 88.33,54.93 77.72,54.93 75.56,57.09 75.56,63.44 X5.7 70.15,65.15 66.99,65.15 66.8,65.34 IC36.37
ADC_VREF
  Top 0.203: IC36.5 65.3,73.11 65.47,73.28
  Top 0.305: 65.47,73.28 69.34,73.28 | 69.34,73.28 69.34,77.85 68.39,78.8 63.88,78.8 | C92.2 69.34,73.28 | IC35.3 63.81,78.87 63.88,78.8 | 63.88,78.8 55.8,78.8 X7.2
AGND2  (via drill 0.4)
  Top 0.305: R74.1 v42.35,71.69 | R75.1 44.58,69.72 v42.35,67.5 27.02,67.5 TVS6.C1 23.7,68.8 X6.6 21.26,69 JP8.1 20.39,68.94 X4.4
  Bottom 0.305: v42.35,67.5 v42.35,71.69
AGND4  (via drill 0.4)  (1 unrouted)
  Top 0.305: 25.43,51.69 TVS8.C1 | TVS8.C1 27.02,50.67 v42.35,50.67 44.64,50.67 48.96,54.99 R83.1 | v42.35,54.86 R82.1 | X4.8 18.87,52.18 JP12.1 25.51,52.18 TVS8.C1
  Bottom 0.305: X6.10 23.5,56.84 18.35,51.69 | v42.35,54.86 v42.35,50.67
AIN0
  Top 0.305: 21.84,80.99 L8.P$2 21.85,80.99 23.5,80.99 | Q6.3 26,80.07 TVS5.C2 24.51,80.99 23.5,80.99 | R62.2 23.5,80.99
AIN1  (via drill 0.4)
  Top 0.305: R63.2 27.43,84.14 v25.59,82.3 | TVS6.C2 25.11,72.01 21.87,72.01 L9.P$2 | TVS6.C2 25.59,71.53 v25.59,75.25 | Q8.3 26,71.69 TVS6.C2
  L3 0.305: v25.59,82.3 v25.59,75.25
AIN_0GND
  Top 0.203: IC36.17 59.3,73.16 58.8,73.66 57.6,73.66 C90.1 55.63,73.98 53.98,73.98 | R71.2 51.75,75.76 53.53,73.98 53.98,73.98 | X7.4 54,73.95 53.98,73.98
AIN_0P
  Top 0.203: IC36.16 59.8,73.29 58.35,74.74 C90.2 58.36,75.37 57.78,75.95 54.04,75.95 | 51.82,80.2 52.13,80.2 52.83,79.5 52.83,76.52 53.4,75.95 54.04,75.95 | X7.3 54,75.91 54.04,75.95
  Top 0.305: R67.2 R64.2 51.82,80.2 | C90.2
AIN_1GND
  Top 0.203: IC36.19 57.68,72.03 C91.1 55.5,70.81 54.67,69.98 54.04,69.98 | 54.04,69.98 52,69.98 R75.2 | X7.6 54,69.94 54.04,69.98
AIN_1P
  Top 0.203: IC36.18 58.8,73.03 58.61,73.22 56.96,73.22 C91.2 55.37,72.7 54.67,72.01 53.98,72.01 | 53.98,72.01 52.07,72.01 R65.2 | X7.5 54,71.98 53.98,72.01
  Top 0.305: R65.2 R73.2
AIN_2GND
  Top 0.203: IC36.20 58.3,65.73 58.29,65.72 57.15,65.72 C97.1 54.03,65.03 X7.8 54,64.8 R79.2
  Top 0.305: R79.2 51.82,62.55
AIN_2P
  Top 0.203: IC36.21 58.8,67.37 58.55,67.63 57.15,67.63 C97.2 54.07,66.93 X7.7 53.48,66.48 R77.2
  Top 0.305: R77.2 R68.2
AIN_3GND  (via drill 0.4)
  Top 0.203: IC36.22 59.3,64.76 C98.1 55.5,60.96 54.04,60.96 X7.10 | R83.2 54.04,57.28 v54.04,58.8
  L2 0.203: 54.04,60.96 X7.10
  Bottom 0.203: v54.04,58.8 54.04,60.96 X7.10
AIN_3P
  Top 0.203: IC36.23 59.8,64.53 C98.2 59.82,63.38 59.82,62.99 56.45,59.63 52.45,59.63 R81.2 | X7.9 54,62.64 51.75,60.39 R81.2 | R81.2
  Top 0.305: R81.2 R69.2
BOOT0  (via drill 0.4)
  Top 0.203: R7.2 123.64,69.98 125.54,68.07 125.54,67.89 IC8.138 121.86,64.2 121.86,55.88 v116.52,50.55 | IC3.13 103.19,35.36 v103.24,35.41
  Bottom 0.203: v116.52,50.55 116.52,49.12 103.24,35.84 v103.24,35.41
CLAMP  (via drill 0.4)
  Top 0.305: R33.2 79.57,88.2 | 79.57,88.2 R34.1 IC20.1 75.75,88.14 v75.75,87.19 | C75.1 79.57,88.2 | D7.2 84.97,84.83 v84.71,85.09 | D8.2 84.97,81.15 v84.71,81.41 | D9.2 84.97,77.47 v84.71,77.72 | D10.2 84.97,73.78 v84.71,74.04 | D11.2 84.97,70.1 v84.71,70.36 | D12.2 84.9,66.42 v84.71,66.61 | D13.2 84.9,62.74 v84.71,62.93 | D14.2 84.97,59.05 v84.71,59.31 | C74.1 v85.03,87.06
  other vias: 82.55,87.06 83.38,87.06 80.07,87.19 78.11,87.19
  pour L3 (isolate 0.254): 75.12,87.5 85.98,87.5 85.98,56.07 82.42,56.07 82.42,85.72 75.12,85.72
CURR_SW0  (via drill 0.4)
  Top 0.203: IC8.117 130.92,58.42 125.67,58.42 v125.35,58.74 | IC27.3 37.27,81.02 v37.27,80.39
  Top 0.305: v44.77,80.14 44.77,80.76 IC22.3
  Bottom 0.203: v125.35,58.74 125.35,59.18 124.59,59.94 122.24,59.94 119.83,62.36 119.19,62.36 119,62.17 107.7,62.17 104.58,59.05 103.06,59.05 101.28,57.28 96.77,57.28 95.76,56.26 60.39,56.26 54.67,61.98 53.4,61.98 52.83,62.55 52.83,72.07 v44.77,80.14 43.69,80.14 42.67,81.15 38.04,81.15 v37.27,80.39
CURR_SW1  (via drill 0.4)
  Top 0.203: IC28.3 37.29,72.08 v37.27,72.01 | IC23.3 44.83,72.63 v44.83,71.94 | IC8.118 130.66,58.86 126.3,58.86 125.67,59.5 124.59,59.5 v124.27,59.18 124.52,59.44
  Bottom 0.203: v124.27,59.18 122.36,59.18 120.71,60.83 119.19,60.83 118.75,61.28 108.08,61.28 103.19,56.39 97.22,56.39 96.2,55.37 55.24,55.37 50.04,60.58 50.04,66.8 49.97,66.8 v44.83,71.94 43.5,71.94 42.67,72.77 38.04,72.77 v37.27,72.01
CURR_SW2  (via drill 0.4)
  Top 0.203: IC29.3 37.29,63.64 v37.27,63.56 | IC24.3 44.83,64.19 v44.83,63.5 | IC8.119 130.4,59.31 126.94,59.31 v126.62,59.63
  Bottom 0.203: v126.62,59.63 126.43,59.44 126.43,58.74 125.67,57.98 124.46,57.98 123.7,58.74 122.17,58.74 121.67,59.24 119.51,59.24 118.94,59.82 110.11,59.82 108.33,58.04 106.17,58.04 103.63,55.5 97.6,55.5 96.58,54.48 54.8,54.48 45.78,63.5 v44.83,63.5 43.5,63.5 42.67,64.33 38.04,64.33 v37.27,63.56
CURR_SW3  (via drill 0.4)
  Top 0.203: IC30.3 37.29,55.19 v37.27,55.18 | IC8.122 129.8,60.83 129.09,60.83 128.78,60.52 v128.78,60.07 | IC25.3 44.84,55.13 v44.83,55.12
  Bottom 0.203: v128.78,60.07 128.4,60.07 125.86,57.53 124.21,57.53 123.44,58.29 118.3,58.29 117.86,58.74 110.3,58.74 108.71,57.15 106.62,57.15 104.08,54.61 97.98,54.61 96.97,53.59 46.35,53.59 v44.83,55.12 43.5,55.12 42.67,55.94 38.04,55.94 v37.27,55.18
DAC_CLR#1  (via drill 0.4)
  Top 0.203: v113.09,55.88 114.17,55.88 114.62,56.33 114.62,60.78 IC8.21 | IC10.6 86.43,46.54 v86.68,46.29
  Bottom 0.203: v86.68,46.29 87.48,45.49 103.15,45.49 113.09,55.44 v113.09,55.88
DAC_CLR#2  (via drill 0.4)
  Top 0.203: v114.17,54.17 115.25,54.17 115.7,54.61 115.7,55.24 115.51,55.44 115.51,61.3 IC8.19 | IC11.6 85.4,29.46 95.06,39.12 95.81,39.12 v96.33,39.64
  Bottom 0.203: v96.33,39.64 100.37,43.67 104.33,43.67 113.3,52.64 113.73,52.64 114.17,53.09 v114.17,54.17
DAC_CLR-SEL#1  (via drill 0.4)
  Top 0.203: v113.86,56.64 113.86,60.84 IC8.22 | IC10.5 83.61,45.89 83.82,46.1 85.28,46.1 v85.6,45.78
  Bottom 0.203: v85.6,45.78 86.35,45.03 103.33,45.03 113.86,55.56 v113.86,56.64
DAC_CLR-SEL#2  (via drill 0.4)
  Top 0.203: IC11.5 82.47,28.83 83.69,28.83 83.88,29.02 85.6,29.02 94.93,38.35 95.66,38.35 v95.67,38.34 | IC8.20 115.06,61.04 115.06,55.05 v114.94,54.93
  Bottom 0.203: v95.67,38.34 96.13,38.34 101,43.22 104.52,43.22 113.5,52.2 113.92,52.2 114.94,53.21 v114.94,54.93
DAC_CS#1  (via drill 0.4)
  Top 0.203: IC8.27 111.82,59.33 111.82,55.23 v111.67,55.08 | IC10.7 87.31,47.19 v87.44,47.05
  Bottom 0.203: v87.44,47.05 88.58,45.91 102.93,45.91 111.67,54.65 v111.67,55.08
DAC_CS#2  (via drill 0.4)
  Top 0.203: v113.41,53.4 115.13,53.4 116.14,54.42 116.14,55.44 115.95,55.63 115.95,61.57 IC8.18 | IC11.7 85.42,30.11 v95.25,39.94
  Bottom 0.203: v113.41,53.4 104.14,44.13 99.44,44.13 v95.25,39.94
DAC_MISO  (via drill 0.4)
  Top 0.203: IC10.10 88.25,49.14 v88.27,49.15 | IC11.10 84.57,32.06 88.52,36.01 v88.52,47.12 | RN4.3 105.16,47.88 v97.85,47.88
  Bottom 0.203: v97.85,47.88 90.11,47.88 89.92,47.69 88.52,47.69 | v88.52,47.12 88.52,47.69 | 88.52,47.69 88.52,48.9 v88.27,49.15
DAC_MOSI  (via drill 0.4)
  Top 0.203: IC13.8 54.86,41.27 55.82,42.23 v55.82,42.29 | IC11.9 84.62,31.41 89.6,36.39 v89.6,46.93 | RN4.4 105.8,47.24 98.74,47.24 v98.61,47.12 | IC10.9 83.47,48.49 83.57,48.39 89.53,48.39 v89.6,48.45
  L3 0.203: v89.6,50.04 v89.6,48.45 v89.6,46.93
  Bottom 0.203: v89.6,50.04 89.28,50.35 63.94,50.35 57.72,44.13 57.72,43.69 56.33,42.29 v55.82,42.29 | v98.61,47.12 97.6,47.12 97.28,47.43 90.3,47.43 89.79,46.93 v89.6,46.93
DAC_OUT#1
  Top 0.305: TVS1.C2 63.06,44.05 D1.3 66.46,44.05 68.33,45.91 L5.P$2 68.29,45.94
  Top 0.406: X3.2 21.1,45.28 C40.1 23.24,45.28 26.16,48.2 55.82,48.2 60.23,43.78 TVS1.C2
DAC_OUT#2
  Top 0.406: L6.P$2 65.66,31.22 D2.3 63,30.97 TVS2.C2 62.51,30.77 59.56,33.72 59.56,43.5 55.5,47.56 28.77,47.56 22.1,40.9 C49.1 20.53,40.9 X3.3
DAC_SCLK  (via drill 0.4)
  Top 0.203: IC13.7 55.44,40.77 v55.75,41.08 | IC11.8 84.61,30.76 90.36,36.51 90.36,47.75 | v97.09,48.64 97.16,48.7 104.71,48.7 RN4.2 | IC10.8 83.59,47.84 83.63,47.88 88.84,47.88 89.03,47.69 90.3,47.69 90.36,47.75 | 90.36,47.75 90.36,48.32 v90.68,48.64
  Bottom 0.203: v97.09,48.64 v90.68,48.64 90.04,49.28 89.22,49.28 88.58,49.91 64.14,49.91 58.17,43.94 58.17,43.5 v55.75,41.08
DIB_A0  (via drill 0.4)
  Top 0.203: RN3.3 93.66,16.64 94.17,16.13 IC1.1 v94.17,14.04 v94.17,14.03
  Bottom 0.203: v94.17,14.03 77.22,14.03 76.14,12.95 76.14,11.26 X1.17
DIB_A1
  Top 0.203: RN3.2 92.77,15.59 IC1.2 92.9,14.35 89.79,11.24 78.68,11.24 77.4,9.96 X1.19
DIB_A2
  Top 0.203: RN3.1 91.87,16.75 91.63,16.51 IC1.3 91.57,15.4 91.57,14.67 90.61,13.72 76.52,13.72 75.3,12.5 X1.18
DIB_BOOT  (via drill 0.4)
  Top 0.203: v103.19,8.83 IC3.4
  Bottom 0.203: X1.26 86.23,11.27 86.23,9.08 87.63,7.68 100.33,7.68 101.47,8.83 v103.19,8.83
DIB_CSA
  Top 0.203: IC2.5 117.98,10.79 117.16,9.97 RN2.2
DIB_CSB  (via drill 0.4)
  Top 0.203: JP1.NO v108.9,7.24 | X1.12 67.22,12.47 68.52,11.18 68.52,9.21 72.26,5.46 108.58,5.46 v108.9,5.14
  Bottom 0.203: v108.9,5.14 v108.9,7.24
DIB_IRQ  (via drill 0.4)
  Top 0.203: v105.16,7.11 105.16,8.26 JP1.NC | v105.16,3.81 104.84,4.13 68.07,4.13 63.44,8.76 63.44,11.26 X1.10
  Bottom 0.203: v105.16,7.11 v105.16,3.81
DIB_MISO
  Top 0.203: IC2.6 119.25,10.79 118.06,9.61 RN2.1
DIB_MOSI
  Top 0.203: IC2.3 115.44,9.25 RN2.4
DIB_NRESET  (via drill 0.4)
  Top 0.203: X1.4 58.36,11.2 58.36,9.08 64.2,3.24 100.97,3.24 101.6,2.6 102.23,2.6 103,3.37 v104.08,3.37 | v104.08,7.11 104.08,9.72 104.46,10.1 IC3.5
  Bottom 0.203: v104.08,7.11 v104.08,3.37
DIB_SCL  (via drill 0.4)
  Top 0.203: IC1.6 91.63,8.76 89.98,7.11 v76.26,7.11
  Bottom 0.203: v76.26,7.11 70.42,7.05 69.41,6.03 63.53,6.03 X1.5
DIB_SCLK
  Top 0.203: IC2.4 116.71,10.35 116.27,9.91 RN2.3
DIB_SDA  (via drill 0.4)
  Top 0.203: IC1.5 90.36,9.14 89.09,7.87 v75.56,7.87
  Bottom 0.203: v75.56,7.87 75.25,7.56 70.29,7.56 69.22,6.48 65.72,6.48 63.44,8.76 63.44,11.2 X1.8
DIN0  (via drill 0.4)
  Top 0.203: 88.52,83.88 88.52,83.94 v88.08,84.39 | v98.55,74.68 98.23,74.36 98.23,59.08 C81.1 101.45,54.49 C76.1 102.51,54.03 106.88,58.4 107.81,58.4 IC8.34
  Top 0.305: R44.2 R52.1 88.52,83.88 D7.3 R36.2
  L3 0.203: v88.08,84.39 88.33,84.14
  Bottom 0.203: v88.08,84.39 88.65,83.82 88.65,81.03 89.09,80.58 91.19,80.58 93.98,77.79 95.44,77.79 v98.55,74.68
DIN1  (via drill 0.4)
  Top 0.203: 88.97,80.9 v89.41,81.34 | v99.63,74.68 99.63,74.55 98.68,73.6 98.68,60.13 v100.72,58.09 | IC8.35 107.53,57.96 107.14,57.96 102.98,53.81 102.98,53.51 v103.07,53.42 102.98,53.33 102.98,52.67 102.38,52.06 C77.1 101.45,51.59 C82.1
  Top 0.305: R45.2 88.97,80.9 R53.1 88.78,80.2 D8.3 R37.2
  L3 0.203: v100.72,58.09 100.72,55.77 v103.07,53.42
  Bottom 0.203: v89.41,81.34 91.06,81.34 94.17,78.23 95.63,78.23 98.42,75.44 98.87,75.44 v99.63,74.68
DIN2  (via drill 0.4)
  Top 0.203: C78.1 131.5,49.56 IC8.96 123.06,57.99 123.06,60.45 122.75,60.77 v122.75,62.04 | 88.97,77.09 v89.41,77.41
  Top 0.305: R46.2 88.97,77.09 R54.1 88.9,76.52 D9.3 R38.2
  L3 0.203: v121.54,66.42 121.54,63.31 122.75,62.1 v122.75,62.04
  Bottom 0.203: v89.41,77.41 93.15,77.41 96.65,73.91 108.75,73.91 115.55,67.12 120.84,67.12 v121.54,66.42
DIN3  (via drill 0.4)
  Top 0.203: C83.1 133.19,50.77 132.4,49.97 131.79,49.97 IC8.97 123.51,58.25 v123.51,61.09 | R55.1 88.97,73.03 v89.41,73.47
  Top 0.305: R47.2 R55.1 88.65,72.83 D10.3 R39.2
  L3 0.203: v120.52,65.91 121.09,65.34 121.09,62.61 122.43,61.28 123.32,61.28 v123.51,61.09
  Bottom 0.203: v89.41,73.47 108.55,73.47 116.42,65.6 120.21,65.6 v120.52,65.91
DIN4  (via drill 0.4)
  Top 0.203: C79.1 128.72,66.67 127.16,66.67 IC8.134 124.97,64.48 124.97,63.6 v124.4,63.02 | R56.1 88.97,69.15 v89.41,69.53
  Top 0.305: R40.2 D11.3 88.39,69.15 R56.1 R48.2
  Bottom 0.203: v89.41,69.53 111.84,69.53 116.22,65.15 124.21,65.15 124.97,64.39 124.97,63.6 v124.4,63.02
DIN5  (via drill 0.4)
  Top 0.203: C84.1 127.5,67.72 IC8.135 124.21,64.43 v124.21,64.07 | R57.1 88.97,65.15 v89.41,65.6
  Top 0.305: R49.2 R57.1 88.33,64.64 87.5,65.47 D12.3 R41.2
  Bottom 0.203: v89.41,65.6 90.3,64.71 122.94,64.71 123.57,64.07 v124.21,64.07
DIN6  (via drill 0.4)
  Top 0.203: C80.1 126.46,67.39 IC8.136 123.44,64.38 123.44,63.12 v123.32,62.99 | R50.2 89.34,62.3 | v89.41,61.66 89.41,61.15 R58.1
  Top 0.305: R42.2 D13.3 87.44,61.78 88.33,62.67 R50.2 R58.1
  Bottom 0.203: v123.32,62.99 123.19,63.12 122.36,63.12 121.67,63.82 91.06,63.82 89.41,62.17 v89.41,61.66
DIN7  (via drill 0.4)
  Top 0.203: C85.1 125.26,68.93 125.98,68.2 125.98,67.62 IC8.137 122.68,64.32 v122.68,63.88 | 88.97,58.1 R51.2 88.39,58.74 v88.08,59.05
  Top 0.305: R59.1 R51.2 88.33,58.1 D14.3 R43.2
  Bottom 0.203: v122.68,63.88 122.3,64.26 90.87,64.26 88.65,62.04 88.65,59.63 v88.08,59.05
DOUT0  (via drill 0.4)
  Top 0.203: IC8.36 108.77,56.02 109.54,56.02 v115.76,49.8 | IC18.2 37.91,18.98 v38.02,18.87
  L3 0.203: v56.79,20.02 39.17,20.02 v38.02,18.87
  Bottom 0.203: v115.76,49.8 115.76,49.01 98.13,31.38 95.38,31.38 84.07,20.08 65.24,20.08 64.49,20.83 57.61,20.83 v56.79,20.02
DOUT1  (via drill 0.4)
  Top 0.203: IC8.101 131.78,52.81 v131.78,52.83 | 39.19,20.02 IC18.3 39.18,17.71 40.75,16.14 40.75,16.13 51.4,16.13 v51.63,15.9
  Bottom 0.203: v131.78,52.83 130.05,52.83 116.65,39.43 114.49,39.43 103.54,28.49 95.73,28.49 85.05,17.8 63.16,17.8 62.19,16.84 55.37,16.84 54.74,16.2 51.93,16.2 v51.63,15.9
DOUT2  (via drill 0.4)
  Top 0.203: IC17.2 45.53,18.66 47.56,16.64 52.9,16.64 53.02,16.51 53.96,16.51 v54.45,16.99 | IC8.91 127.48,50.04 v126.15,50.04
  Bottom 0.203: v126.15,50.04 126.15,49.58 116.46,39.89 114.3,39.89 103.35,28.94 95.54,28.94 84.86,18.26 62.97,18.26 61.98,17.27 54.72,17.27 v54.45,16.99
DOUT3  (via drill 0.4)
  Top 0.203: v53.34,17.27 53.15,17.08 47.75,17.08 46.8,18.03 IC17.3 | IC8.92 127.43,50.8 v125.39,50.8
  Bottom 0.203: v53.34,17.27 53.78,17.72 61.78,17.72 62.79,18.72 84.67,18.72 95.35,29.4 103.16,29.4 114.11,40.35 116.27,40.35 125.39,49.47 v125.39,50.8
DOUT4  (via drill 0.4)
  Top 0.203: IC16.2 53.15,19.49 55.37,17.27 56.83,17.27 57.09,17.53 83.38,17.53 94.49,28.64 v94.49,35.03 | IC8.44 109.35,50.99 109.35,49.78 103.77,44.21 v103.77,42.48
  Bottom 0.203: 95.92,35.03 v94.49,35.03 96.32,35.03 v103.77,42.48
DOUT5  (via drill 0.4)
  Top 0.203: IC16.3 54.42,18.86 55.56,17.72 56.64,17.72 56.9,17.97 83.19,17.97 93.85,28.64 93.85,34.1 v93.73,34.23 | IC8.45 109.79,50.72 109.79,49.59 104.85,44.65 v104.85,42.16